# EAGLE design registers-tmp (EAGLE 5.11)

## Sheet 1 of 3
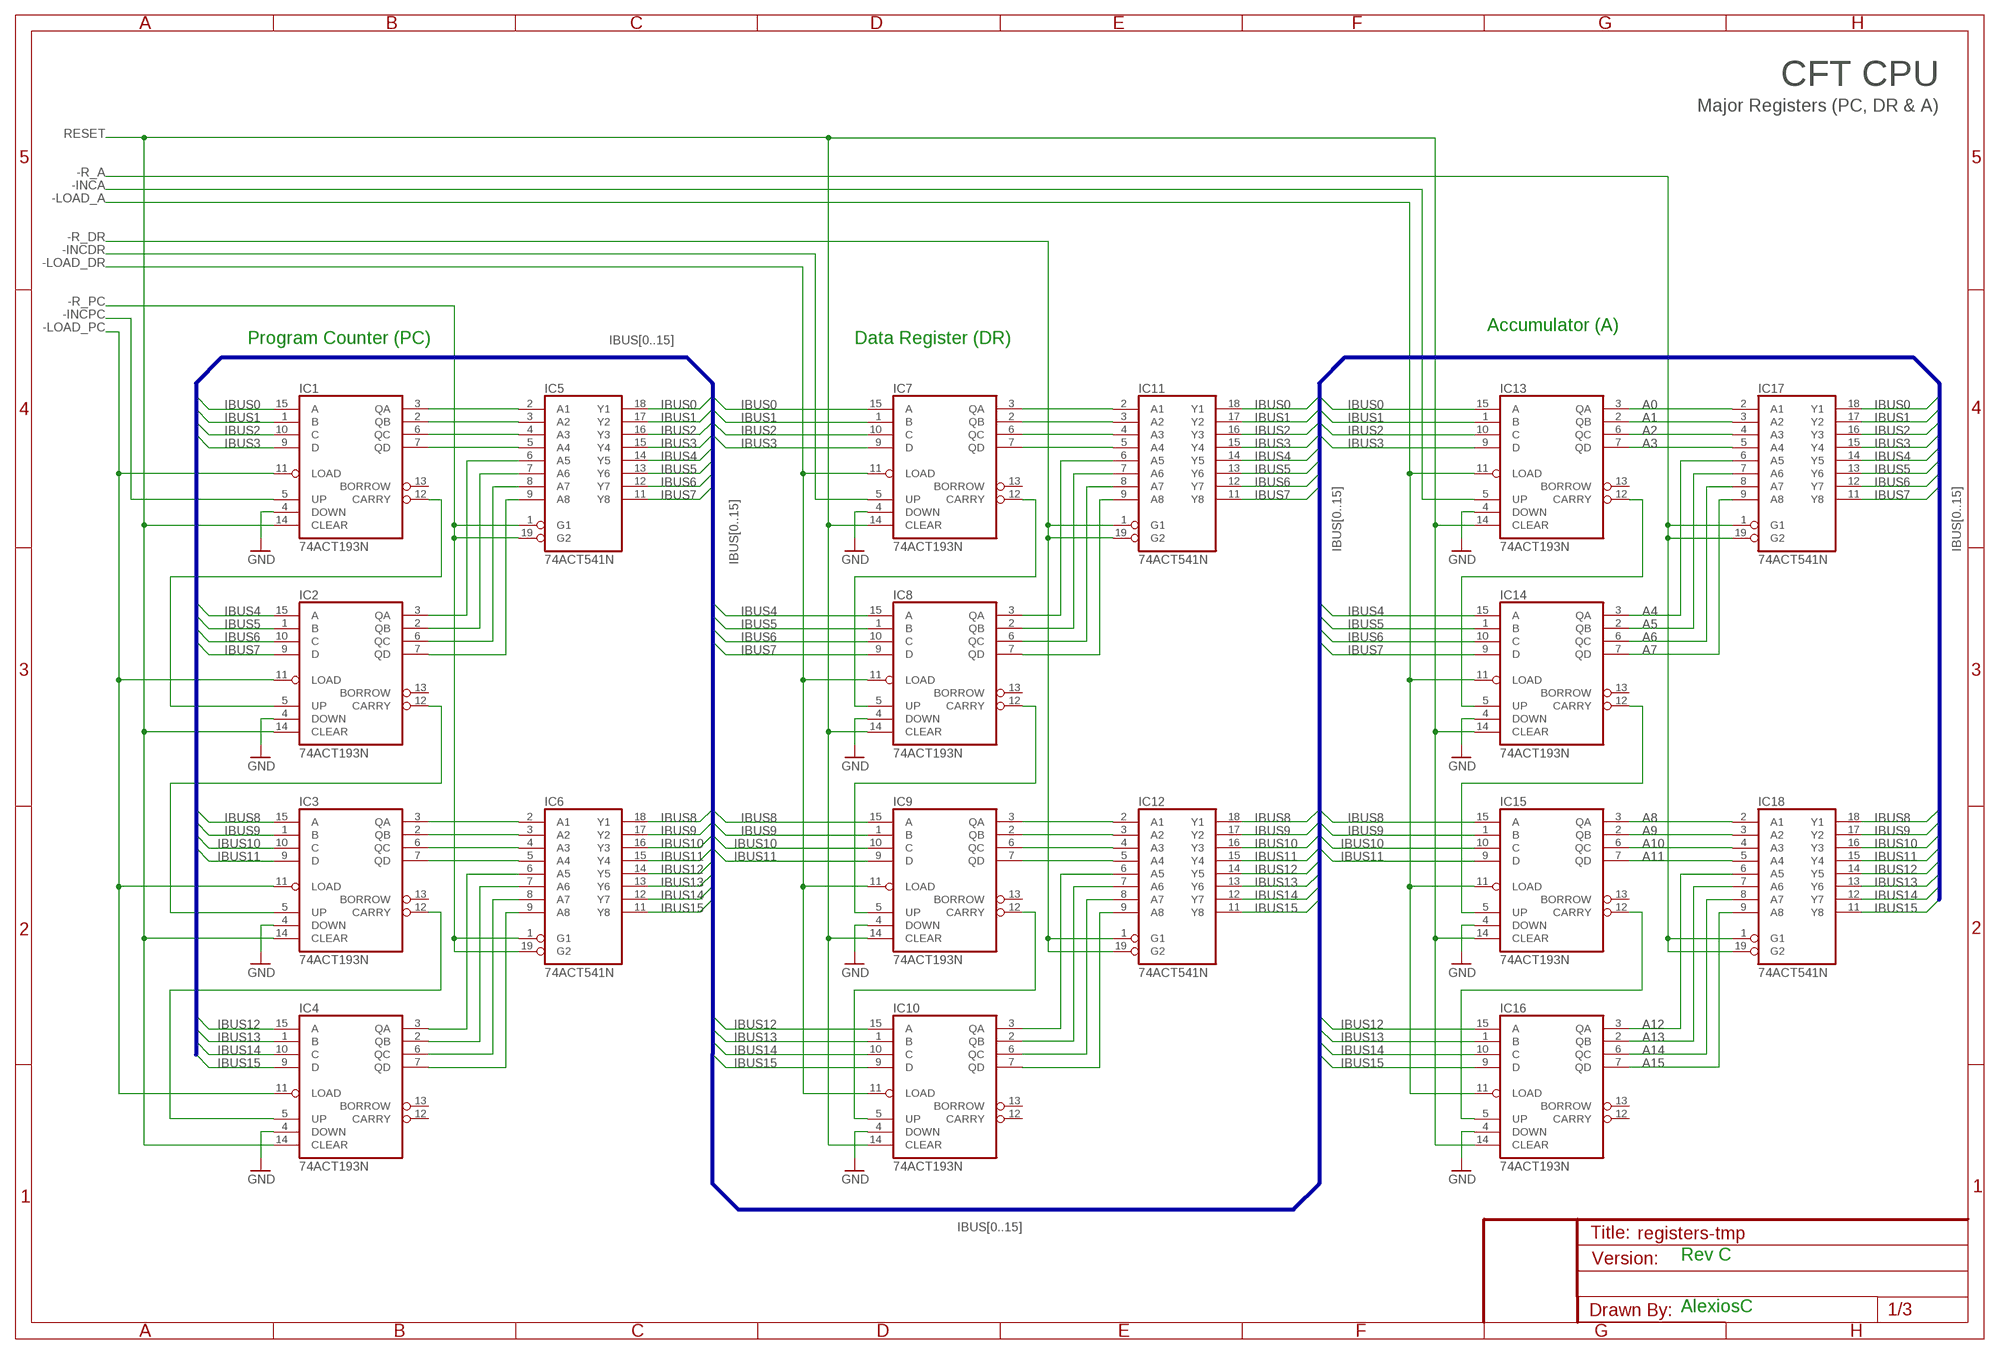
[diagram p0: schematic, sheet 1]

### Parts
IC1  74ACT193N  [DIL16]
IC2  74ACT193N  [DIL16]
IC3  74ACT193N  [DIL16]
IC4  74ACT193N  [DIL16]
IC5  74ACT541N  [DIL20]
IC6  74ACT541N  [DIL20]
IC7  74ACT193N  [DIL16]
IC8  74ACT193N  [DIL16]
IC9  74ACT193N  [DIL16]
IC10  74ACT193N  [DIL16]
IC11  74ACT541N  [DIL20]
IC12  74ACT541N  [DIL20]
IC13  74ACT193N  [DIL16]
IC14  74ACT193N  [DIL16]
IC15  74ACT193N  [DIL16]
IC16  74ACT193N  [DIL16]
IC17  74ACT541N  [DIL20]
IC18  74ACT541N  [DIL20]

### Nets
-INCA: IC13.5(UP) ; also sheet 3
-INCDR: IC7.5(UP) ; also sheet 3
-INCPC: IC1.5(UP) ; also sheet 3
-LOAD_A: IC13.11(LOAD) IC14.11(LOAD) IC15.11(LOAD) IC16.11(LOAD)
-LOAD_DR: IC7.11(LOAD) IC8.11(LOAD) IC9.11(LOAD) IC10.11(LOAD)
-LOAD_PC: IC1.11(LOAD) IC2.11(LOAD) IC3.11(LOAD) IC4.11(LOAD)
-R_A: IC17.1(G1) IC17.19(G2) IC18.1(G1) IC18.19(G2) ; also sheet 3
-R_DR: IC11.1(G1) IC11.19(G2) IC12.1(G1) IC12.19(G2) ; also sheet 3
-R_PC: IC5.1(G1) IC5.19(G2) IC6.1(G1) IC6.19(G2) ; also sheet 3
A0: IC13.3(QA) IC17.2(A1) ; also sheet 2
A1: IC13.2(QB) IC17.3(A2) ; also sheet 2
A2: IC13.6(QC) IC17.4(A3) ; also sheet 2
A3: IC13.7(QD) IC17.5(A4) ; also sheet 2
A4: IC14.3(QA) IC17.6(A5) ; also sheet 2
A5: IC14.2(QB) IC17.7(A6) ; also sheet 2
A6: IC14.6(QC) IC17.8(A7) ; also sheet 2
A7: IC14.7(QD) IC17.9(A8) ; also sheet 2
A8: IC15.3(QA) IC18.2(A1) ; also sheet 2
A9: IC15.2(QB) IC18.3(A2) ; also sheet 2
A10: IC15.6(QC) IC18.4(A3) ; also sheet 2
A11: IC15.7(QD) IC18.5(A4) ; also sheet 2
A12: IC16.3(QA) IC18.6(A5) ; also sheet 2
A13: IC16.2(QB) IC18.7(A6) ; also sheet 2
A14: IC16.6(QC) IC18.8(A7) ; also sheet 2
A15: IC16.7(QD) IC18.9(A8) ; also sheet 2
GND [Power]: IC1.4(DOWN) IC2.4(DOWN) IC3.4(DOWN) IC4.4(DOWN) IC7.4(DOWN) IC8.4(DOWN) IC9.4(DOWN) IC10.4(DOWN) IC13.4(DOWN) IC14.4(DOWN) IC15.4(DOWN) IC16.4(DOWN) ; also sheet 2,3
IBUS0: IC1.15(A) IC5.18(Y1) IC7.15(A) IC11.18(Y1) IC13.15(A) IC17.18(Y1) ; also sheet 3
IBUS1: IC1.1(B) IC5.17(Y2) IC7.1(B) IC11.17(Y2) IC13.1(B) IC17.17(Y2) ; also sheet 3
IBUS2: IC1.10(C) IC5.16(Y3) IC7.10(C) IC11.16(Y3) IC13.10(C) IC17.16(Y3) ; also sheet 3
IBUS3: IC1.9(D) IC5.15(Y4) IC7.9(D) IC11.15(Y4) IC13.9(D) IC17.15(Y4) ; also sheet 3
IBUS4: IC2.15(A) IC5.14(Y5) IC8.15(A) IC11.14(Y5) IC14.15(A) IC17.14(Y5) ; also sheet 3
IBUS5: IC2.1(B) IC5.13(Y6) IC8.1(B) IC11.13(Y6) IC14.1(B) IC17.13(Y6) ; also sheet 3
IBUS6: IC2.10(C) IC5.12(Y7) IC8.10(C) IC11.12(Y7) IC14.10(C) IC17.12(Y7) ; also sheet 3
IBUS7: IC2.9(D) IC5.11(Y8) IC8.9(D) IC11.11(Y8) IC14.9(D) IC17.11(Y8) ; also sheet 3
IBUS8: IC3.15(A) IC6.18(Y1) IC9.15(A) IC12.18(Y1) IC15.15(A) IC18.18(Y1) ; also sheet 3
IBUS9: IC3.1(B) IC6.17(Y2) IC9.1(B) IC12.17(Y2) IC15.1(B) IC18.17(Y2) ; also sheet 3
IBUS10: IC3.10(C) IC6.16(Y3) IC9.10(C) IC12.16(Y3) IC15.10(C) IC18.16(Y3) ; also sheet 3
IBUS11: IC3.9(D) IC6.15(Y4) IC9.9(D) IC12.15(Y4) IC15.9(D) IC18.15(Y4) ; also sheet 3
IBUS12: IC4.15(A) IC6.14(Y5) IC10.15(A) IC12.14(Y5) IC16.15(A) IC18.14(Y5) ; also sheet 3
IBUS13: IC4.1(B) IC6.13(Y6) IC10.1(B) IC12.13(Y6) IC16.1(B) IC18.13(Y6) ; also sheet 3
IBUS14: IC4.10(C) IC6.12(Y7) IC10.10(C) IC12.12(Y7) IC16.10(C) IC18.12(Y7) ; also sheet 3
IBUS15: IC4.9(D) IC6.11(Y8) IC10.9(D) IC12.11(Y8) IC16.9(D) IC18.11(Y8) ; also sheet 3
N$3: IC1.3(QA) IC5.2(A1)
N$4: IC1.2(QB) IC5.3(A2)
N$5: IC1.6(QC) IC5.4(A3)
N$6: IC1.7(QD) IC5.5(A4)
N$7: IC2.3(QA) IC5.6(A5)
N$8: IC2.2(QB) IC5.7(A6)
N$9: IC2.6(QC) IC5.8(A7)
N$10: IC2.7(QD) IC5.9(A8)
N$11: IC3.3(QA) IC6.2(A1)
N$12: IC3.2(QB) IC6.3(A2)
N$13: IC3.6(QC) IC6.4(A3)
N$14: IC4.3(QA) IC6.6(A5)
N$15: IC4.2(QB) IC6.7(A6)
N$22: IC3.7(QD) IC6.5(A4)
N$25: IC1.12(CARRY) IC2.5(UP)
N$26: IC13.12(CARRY) IC14.5(UP)
N$27: IC14.12(CARRY) IC15.5(UP)
N$28: IC7.12(CARRY) IC8.5(UP)
N$29: IC2.12(CARRY) IC3.5(UP)
N$30: IC8.12(CARRY) IC9.5(UP)
N$31: IC3.12(CARRY) IC4.5(UP)
N$32: IC4.6(QC) IC6.8(A7)
N$33: IC4.7(QD) IC6.9(A8)
N$39: IC9.12(CARRY) IC10.5(UP)
N$43: IC7.3(QA) IC11.2(A1)
N$44: IC7.2(QB) IC11.3(A2)
N$45: IC7.6(QC) IC11.4(A3)
N$46: IC7.7(QD) IC11.5(A4)
N$58: IC8.3(QA) IC11.6(A5)
N$66: IC8.2(QB) IC11.7(A6)
N$67: IC8.6(QC) IC11.8(A7)
N$68: IC8.7(QD) IC11.9(A8)
N$69: IC9.3(QA) IC12.2(A1)
N$70: IC9.2(QB) IC12.3(A2)
N$71: IC9.6(QC) IC12.4(A3)
N$72: IC9.7(QD) IC12.5(A4)
N$73: IC10.3(QA) IC12.6(A5)
N$74: IC10.2(QB) IC12.7(A6)
N$75: IC10.6(QC) IC12.8(A7)
N$76: IC10.7(QD) IC12.9(A8)
N$77: IC15.12(CARRY) IC16.5(UP)
RESET: IC1.14(CLEAR) IC2.14(CLEAR) IC3.14(CLEAR) IC4.14(CLEAR) IC7.14(CLEAR) IC8.14(CLEAR) IC9.14(CLEAR) IC10.14(CLEAR) IC13.14(CLEAR) IC14.14(CLEAR) IC15.14(CLEAR) IC16.14(CLEAR) ; also sheet 2
Unconnected: IC1.13(BORROW) IC2.13(BORROW) IC3.13(BORROW) IC4.12(CARRY) IC4.13(BORROW) IC7.13(BORROW) IC8.13(BORROW) IC9.13(BORROW) IC10.12(CARRY) IC10.13(BORROW) IC13.13(BORROW) IC14.13(BORROW) IC15.13(BORROW) IC16.12(CARRY) IC16.13(BORROW)

### Buses
IBUS[0..15]

### Notes on the sheet
- CFT CPU
- Major Registers (PC, DR & A)
- Accumulator (A)
- Program Counter (PC) | Data Register (DR)
- Rev C
- AlexiosC

## Sheet 2 of 3
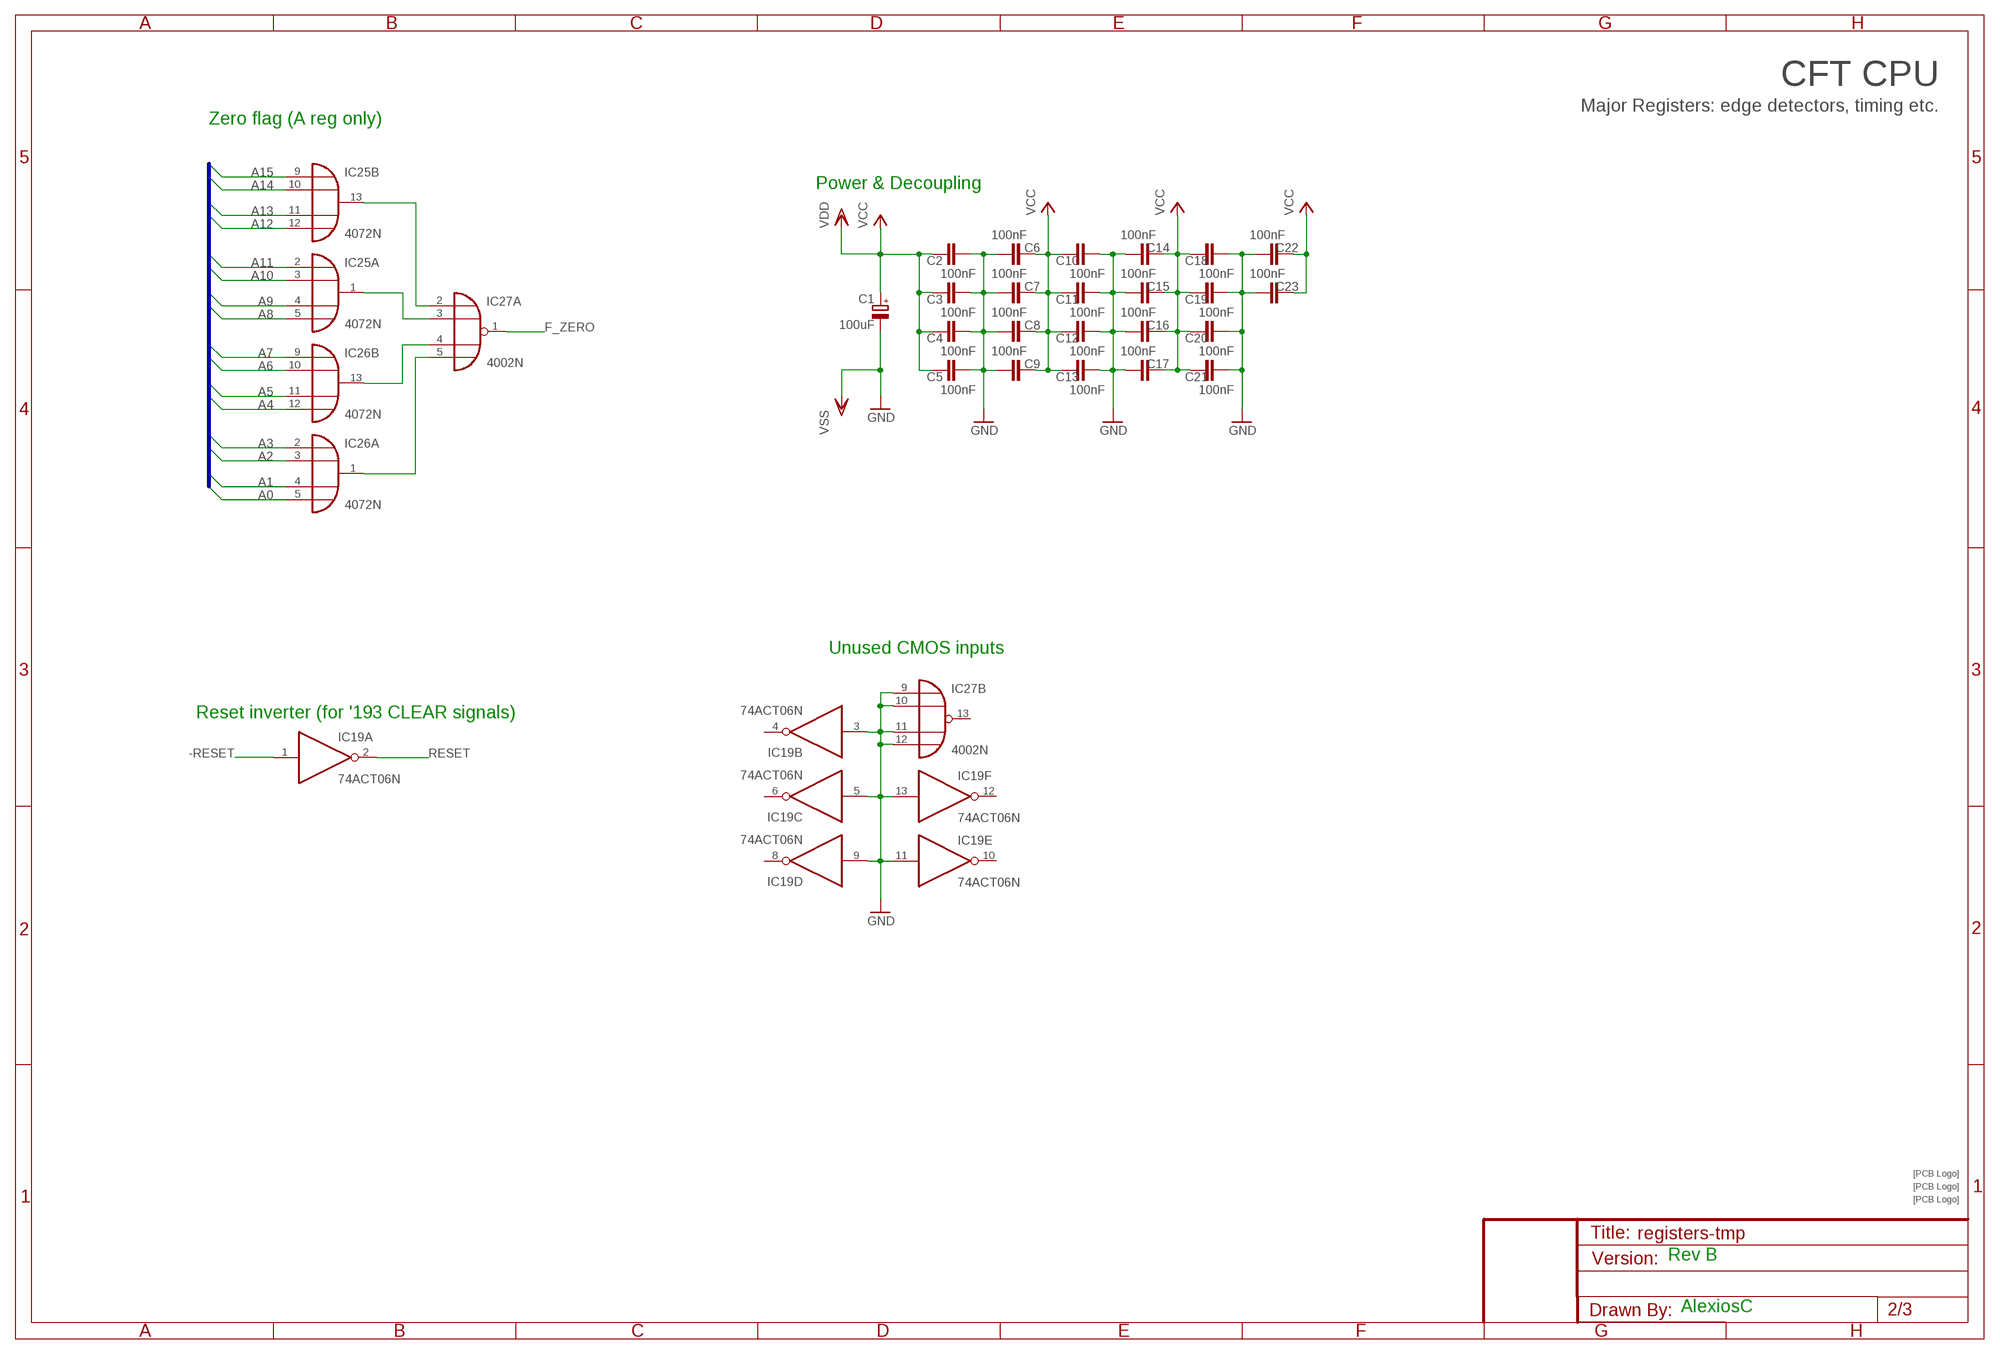
[diagram p1: schematic, sheet 2]

### Parts
C1  100uF  CPOL-EUE2.5-6  [E2,5-6]
C2  100nF  C-EU025-025X050  [C025-025X050]
C3  100nF  C-EU025-025X050  [C025-025X050]
C4  100nF  C-EU025-025X050  [C025-025X050]
C5  100nF  C-EU025-025X050  [C025-025X050]
C6  100nF  C-EU025-025X050  [C025-025X050]
C7  100nF  C-EU025-025X050  [C025-025X050]
C8  100nF  C-EU025-025X050  [C025-025X050]
C9  100nF  C-EU025-025X050  [C025-025X050]
C10  100nF  C-EU025-025X050  [C025-025X050]
C11  100nF  C-EU025-025X050  [C025-025X050]
C12  100nF  C-EU025-025X050  [C025-025X050]
C13  100nF  C-EU025-025X050  [C025-025X050]
C14  100nF  C-EU025-025X050  [C025-025X050]
C15  100nF  C-EU025-025X050  [C025-025X050]
C16  100nF  C-EU025-025X050  [C025-025X050]
C17  100nF  C-EU025-025X050  [C025-025X050]
C18  100nF  C-EU025-025X050  [C025-025X050]
C19  100nF  C-EU025-025X050  [C025-025X050]
C20  100nF  C-EU025-025X050  [C025-025X050]
C21  100nF  C-EU025-025X050  [C025-025X050]
C22  100nF  C-EU025-025X050  [C025-025X050]
C23  100nF  C-EU025-025X050  [C025-025X050]
IC19  74ACT06N  [DIL14]
IC25  4072N  [DIL14]
IC26  4072N  [DIL14]
IC27  4002N  [DIL14]
U$4  SIGNATUREPLANE  [SIGNATURE_PLANE]
U$5  SIGNATUREPLANE  [SIGNATURE_PLANE]
U$6  SIGNATURESILK  [SIGNATURE]

### Nets
-RESET: IC19.1(A:I) ; also sheet 3
A0: IC26.5(A:I3) ; also sheet 1
A1: IC26.4(A:I2) ; also sheet 1
A2: IC26.3(A:I1) ; also sheet 1
A3: IC26.2(A:I0) ; also sheet 1
A4: IC26.12(B:I3) ; also sheet 1
A5: IC26.11(B:I2) ; also sheet 1
A6: IC26.10(B:I1) ; also sheet 1
A7: IC26.9(B:I0) ; also sheet 1
A8: IC25.5(A:I3) ; also sheet 1
A9: IC25.4(A:I2) ; also sheet 1
A10: IC25.3(A:I1) ; also sheet 1
A11: IC25.2(A:I0) ; also sheet 1
A12: IC25.12(B:I3) ; also sheet 1
A13: IC25.11(B:I2) ; also sheet 1
A14: IC25.10(B:I1) ; also sheet 1
A15: IC25.9(B:I0) ; also sheet 1
F_ZERO: IC27.1(A:O) ; also sheet 3
GND [Power]: C1.- C2.1 C3.1 C4.1 C5.1 C6.1 C7.1 C8.1 C9.1 C10.1 C11.1 C12.1 C13.1 C14.1 C15.1 C16.1 C17.1 C18.1 C19.1 C20.1 C21.1 C22.1 C23.1 IC19.3(B:I) IC19.5(C:I) IC19.9(D:I) IC19.11(E:I) IC19.13(F:I) IC27.9(B:I0) IC27.10(B:I1) IC27.11(B:I2) IC27.12(B:I3) ; supply symbol labelled VSS ; also sheet 1,3
N$17: IC25.13(B:O) IC27.2(A:I0)
N$18: IC25.1(A:O) IC27.3(A:I1)
N$19: IC26.13(B:O) IC27.4(A:I2)
N$20: IC26.1(A:O) IC27.5(A:I3)
RESET: IC19.2(A:O) ; also sheet 1
VCC [Power]: C1.+ C2.2 C3.2 C4.2 C5.2 C6.2 C7.2 C8.2 C9.2 C10.2 C11.2 C12.2 C13.2 C14.2 C15.2 C16.2 C17.2 C18.2 C19.2 C20.2 C21.2 C22.2 C23.2 ; supply symbol labelled VDD ; also sheet 3
Unconnected: IC19.4(B:O) IC19.6(C:O) IC19.8(D:O) IC19.10(E:O) IC19.12(F:O) IC27.13(B:O)

### Buses
REG[0..15]

### Notes on the sheet
- CFT CPU
- Major Registers: edge detectors, timing etc.
- Zero flag (A reg only)
- Power & Decoupling
- Unused CMOS inputs
- Reset inverter (for '193 CLEAR signals)
- Rev B
- AlexiosC

## Sheet 3 of 3
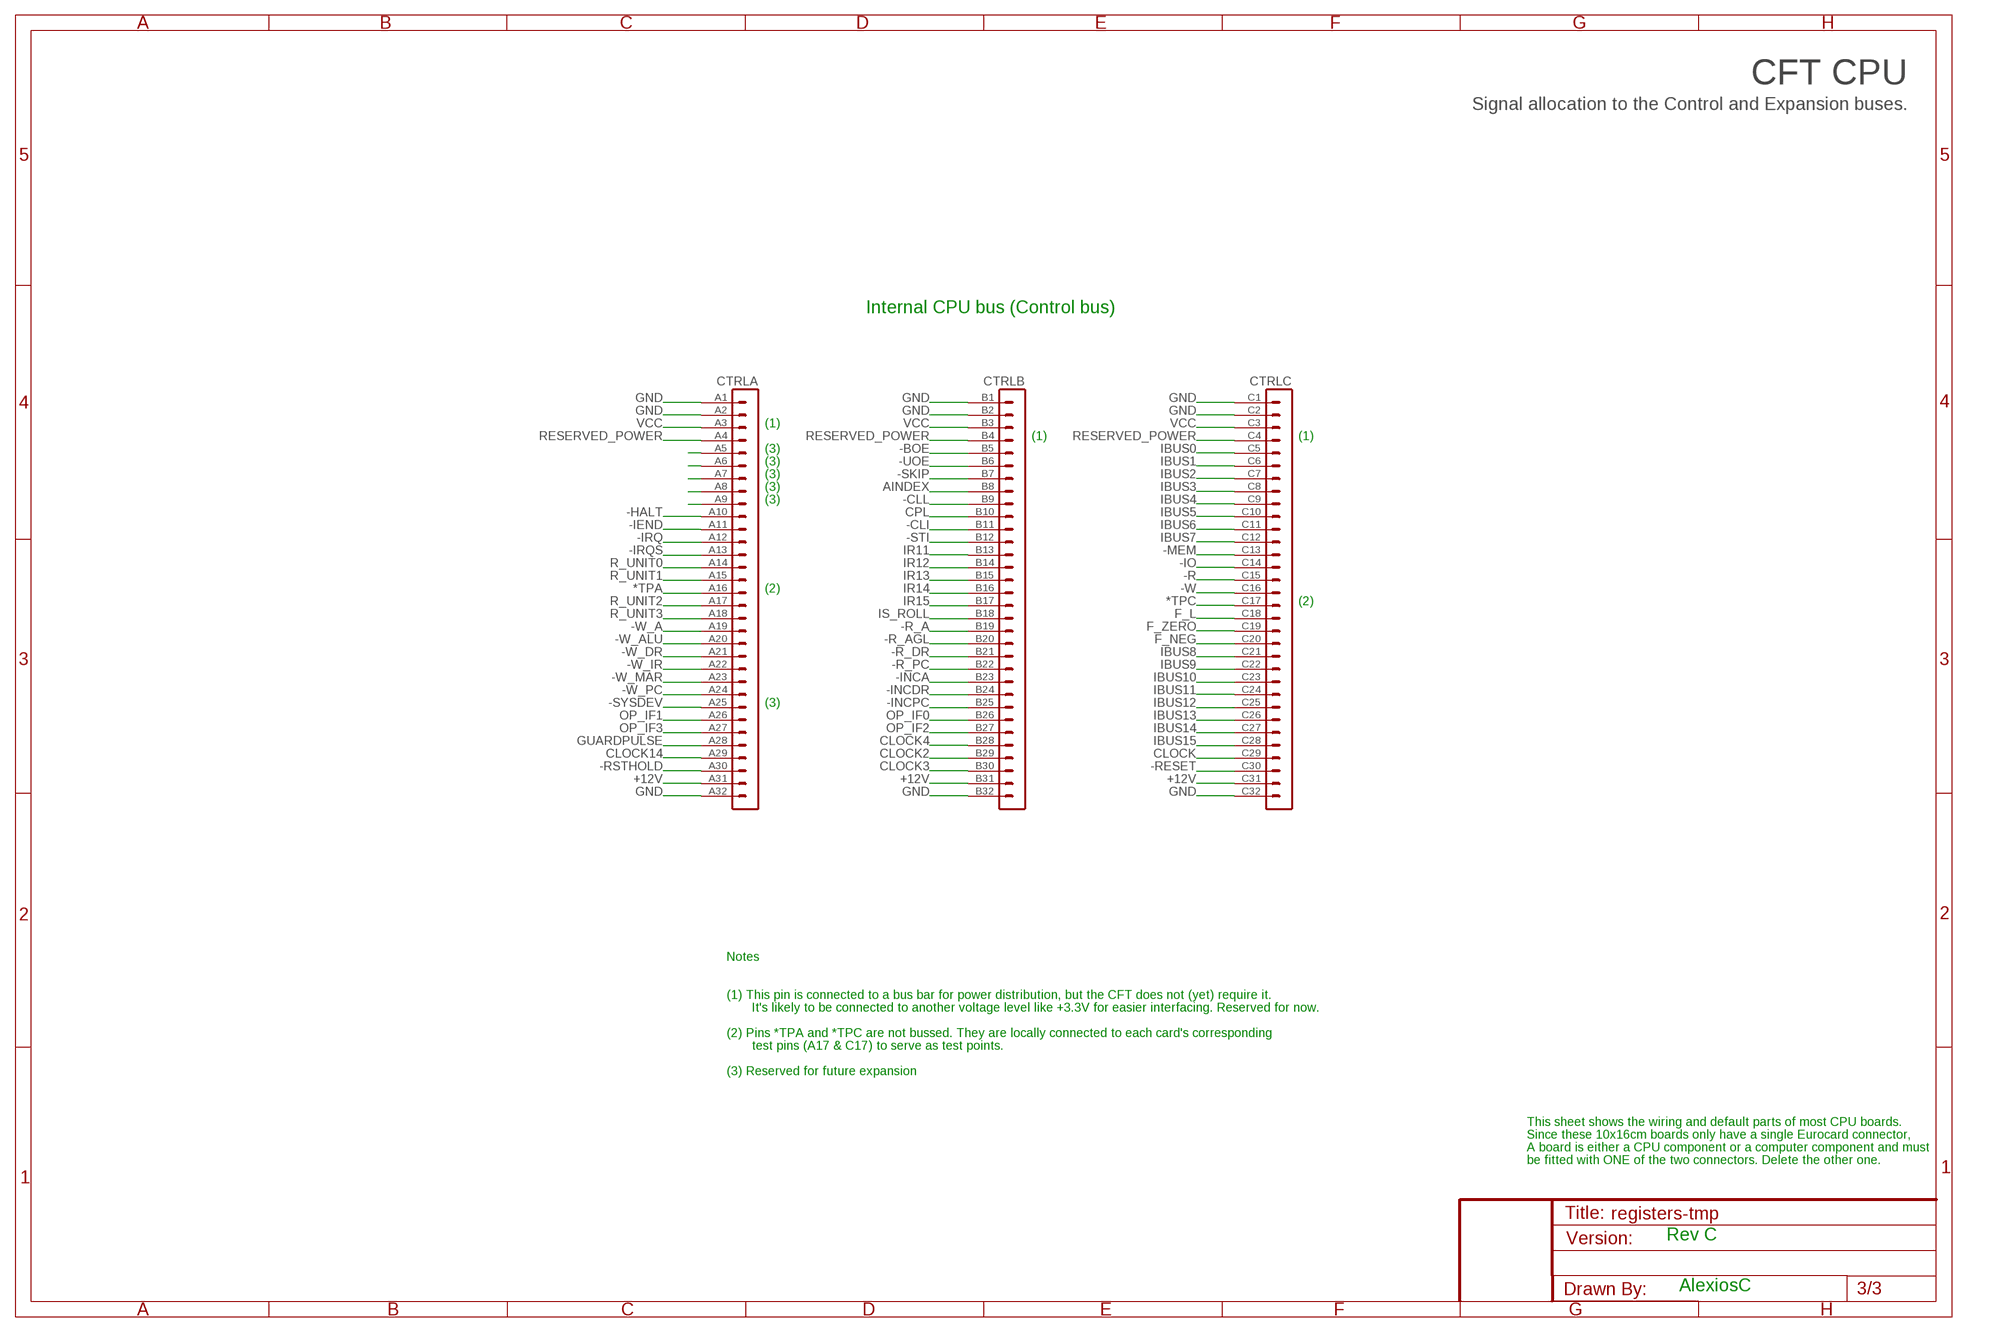
[diagram p2: schematic, sheet 3]

### Parts
CTRL  VG96-3B  [VG96B]

### Nets
*TPA: CTRL.A16
*TPC: CTRL.C17
+12V [12V]: CTRL.A31 CTRL.B31 CTRL.C31
-BOE: CTRL.B5
-CLI: CTRL.B11
-CLL: CTRL.B9
-HALT: CTRL.A10
-IEND: CTRL.A11
-INCA: CTRL.B23 ; also sheet 1
-INCDR: CTRL.B24 ; also sheet 1
-INCPC: CTRL.B25 ; also sheet 1
-IO: CTRL.C14
-IRQ: CTRL.A12
-IRQS: CTRL.A13
-MEM: CTRL.C13
-R: CTRL.C15
-R_A: CTRL.B19 ; also sheet 1
-R_AGL: CTRL.B20
-R_DR: CTRL.B21 ; also sheet 1
-R_PC: CTRL.B22 ; also sheet 1
-RESET: CTRL.C30 ; also sheet 2
-RSTHOLD: CTRL.A30
-SKIP: CTRL.B7
-STI: CTRL.B12
-SYSDEV: CTRL.A25
-UOE: CTRL.B6
-W: CTRL.C16
-W_A: CTRL.A19
-W_ALU: CTRL.A20
-W_DR: CTRL.A21
-W_IR: CTRL.A22
-W_MAR: CTRL.A23
-W_PC: CTRL.A24
AINDEX: CTRL.B8
CLOCK: CTRL.C29
CLOCK2: CTRL.B29
CLOCK3: CTRL.B30
CLOCK4: CTRL.B28
CLOCK14: CTRL.A29
CPL: CTRL.B10
F_L: CTRL.C18
F_NEG: CTRL.C20
F_ZERO: CTRL.C19 ; also sheet 2
GND [Power]: CTRL.A1 CTRL.A2 CTRL.A32 CTRL.B1 CTRL.B2 CTRL.B32 CTRL.C1 CTRL.C2 CTRL.C32 ; also sheet 1,2
GUARDPULSE: CTRL.A28
IBUS0: CTRL.C5 ; also sheet 1
IBUS1: CTRL.C6 ; also sheet 1
IBUS2: CTRL.C7 ; also sheet 1
IBUS3: CTRL.C8 ; also sheet 1
IBUS4: CTRL.C9 ; also sheet 1
IBUS5: CTRL.C10 ; also sheet 1
IBUS6: CTRL.C11 ; also sheet 1
IBUS7: CTRL.C12 ; also sheet 1
IBUS8: CTRL.C21 ; also sheet 1
IBUS9: CTRL.C22 ; also sheet 1
IBUS10: CTRL.C23 ; also sheet 1
IBUS11: CTRL.C24 ; also sheet 1
IBUS12: CTRL.C25 ; also sheet 1
IBUS13: CTRL.C26 ; also sheet 1
IBUS14: CTRL.C27 ; also sheet 1
IBUS15: CTRL.C28 ; also sheet 1
IR11: CTRL.B13
IR12: CTRL.B14
IR13: CTRL.B15
IR14: CTRL.B16
IR15: CTRL.B17
IS_ROLL: CTRL.B18
N$2: CTRL.A5
N$48: CTRL.A9
N$49: CTRL.A8
N$50: CTRL.A7
N$51: CTRL.A6
OP_IF0: CTRL.B26
OP_IF1: CTRL.A26
OP_IF2: CTRL.B27
OP_IF3: CTRL.A27
R_UNIT0: CTRL.A14
R_UNIT1: CTRL.A15
R_UNIT2: CTRL.A17
R_UNIT3: CTRL.A18
RESERVED_POWER: CTRL.A4 CTRL.B4 CTRL.C4
VCC [Power]: CTRL.A3 CTRL.B3 CTRL.C3 ; also sheet 2

### Notes on the sheet
- CFT CPU
- Signal allocation to the Control and Expansion buses.
- Internal CPU bus (Control bus)
- (1)
- (1) | (1)
- (3)
- (3)
- (3)
- (3)
- (3)
- (2)
- (2)
- (3)
- Notes
- (1) This pin is connected to a bus bar for power distribution, but the CFT does not (yet) require it.
- It's likely to be connected to another voltage level like +3.3V for easier interfacing. Reserved for now.
- (2) Pins *TPA and *TPC are not bussed. They are locally connected to each card's corresponding
- test pins (A17 & C17) to serve as test points.
- (3) Reserved for future expansion
- This sheet shows the wiring and default parts of most CPU boards.
- Since these 10x16cm boards only have a single Eurocard connector,
- A board is either a CPU component or a computer component and must
- be fitted with ONE of the two connectors. Delete the other one.
- Rev C
- AlexiosC

## Power pins joined to a net without a drawn wire
GND: IC1.8(GND) IC2.8(GND) IC3.8(GND) IC4.8(GND) IC5.10(GND) IC6.10(GND) IC7.8(GND) IC8.8(GND) IC9.8(GND) IC10.8(GND) IC11.10(GND) IC12.10(GND) IC13.8(GND) IC14.8(GND) IC15.8(GND) IC16.8(GND) IC17.10(GND) IC18.10(GND) IC19.7(P:GND) IC25.7(P:VSS) IC26.7(P:VSS) IC27.7(P:VSS)
VCC: IC1.16(VCC) IC2.16(VCC) IC3.16(VCC) IC4.16(VCC) IC5.20(VCC) IC6.20(VCC) IC7.16(VCC) IC8.16(VCC) IC9.16(VCC) IC10.16(VCC) IC11.20(VCC) IC12.20(VCC) IC13.16(VCC) IC14.16(VCC) IC15.16(VCC) IC16.16(VCC) IC17.20(VCC) IC18.20(VCC) IC19.14(P:VCC) IC25.14(P:VDD) IC26.14(P:VDD) IC27.14(P:VDD)

## Library data of the parts
C1 = rcl:CPOL-EU: POLARIZED CAPACITOR, European symbol
C2-C23 = rcl:C-EU: CAPACITOR, European symbol
CTRL = 19inch:VG96-3: PCB EUROCARD, 96-pin type C/ABC, 2.54 mm
IC1-IC4 IC7-IC10 IC13-IC16 = alexios:74*193: Presettable Synchronous Binary Up/Down Counter Up/down 4-bit binary counter with load and clear inputs, and borrow and carry outputs. Farnell description: <http://uk.farnell.com/nxp/74hct193n/ic-74hct-cmos-74hct193-dip16-5v/dp/382218> Order Code: 382218 Manufacturer Part No: 74HCT193N RoHS : Yes Description: IC, 74HCT CMOS, 74HCT193, DIP16, 5V Counter Type:Binary Clock Frequency:47MHz Count Maximum:15 Supply Voltage Range:4.5V to 5.5V Logic Case Style:DIP No. of Pins:16 Operating Temperature Range:-40°C to +125°C Base Number:74 Clock Frequency Max:43MHz Count Max:16 Counter Measuring Functions:Presettable Synchronous Binary Up / Down Counter Device Marking:74HCT193 IC Generic Number:74HCT193 Logic Function Number:193 Logic IC Base Number:74193 Logic IC Family:HCT Logic IC Function:Presettable Synchronous 4bit Binary Up/Down Counter No. of Gates:1 No. of Inputs:4 Operating Temperature Max:125°C Operating Temperature Min:-40°C Package / Case:DIP Supply Voltage:5V Supply Voltage Max:5.5V Supply Voltage Min:4.5V Termination Type:Through Hole
IC5 IC6 IC11 IC12 IC17 IC18 = 74xx-eu:74*541: Octal BUFFER and LINE DRIVER, 3-state
IC19 = 74xx-eu:74*06: Hex INVERTER, open collector high-voltage output
IC25 IC26 = 40xx:4072: Dual 4-input OR
IC27 = 40xx:4002: 4-input NOR
U$4-U$6 = alexios:SIGNATURE: Soup signature

## Net classes
1 Power: width 1.016 mm, clearance 0.305 mm
2 12V: width 1.016 mm, clearance 0.61 mm

## Board
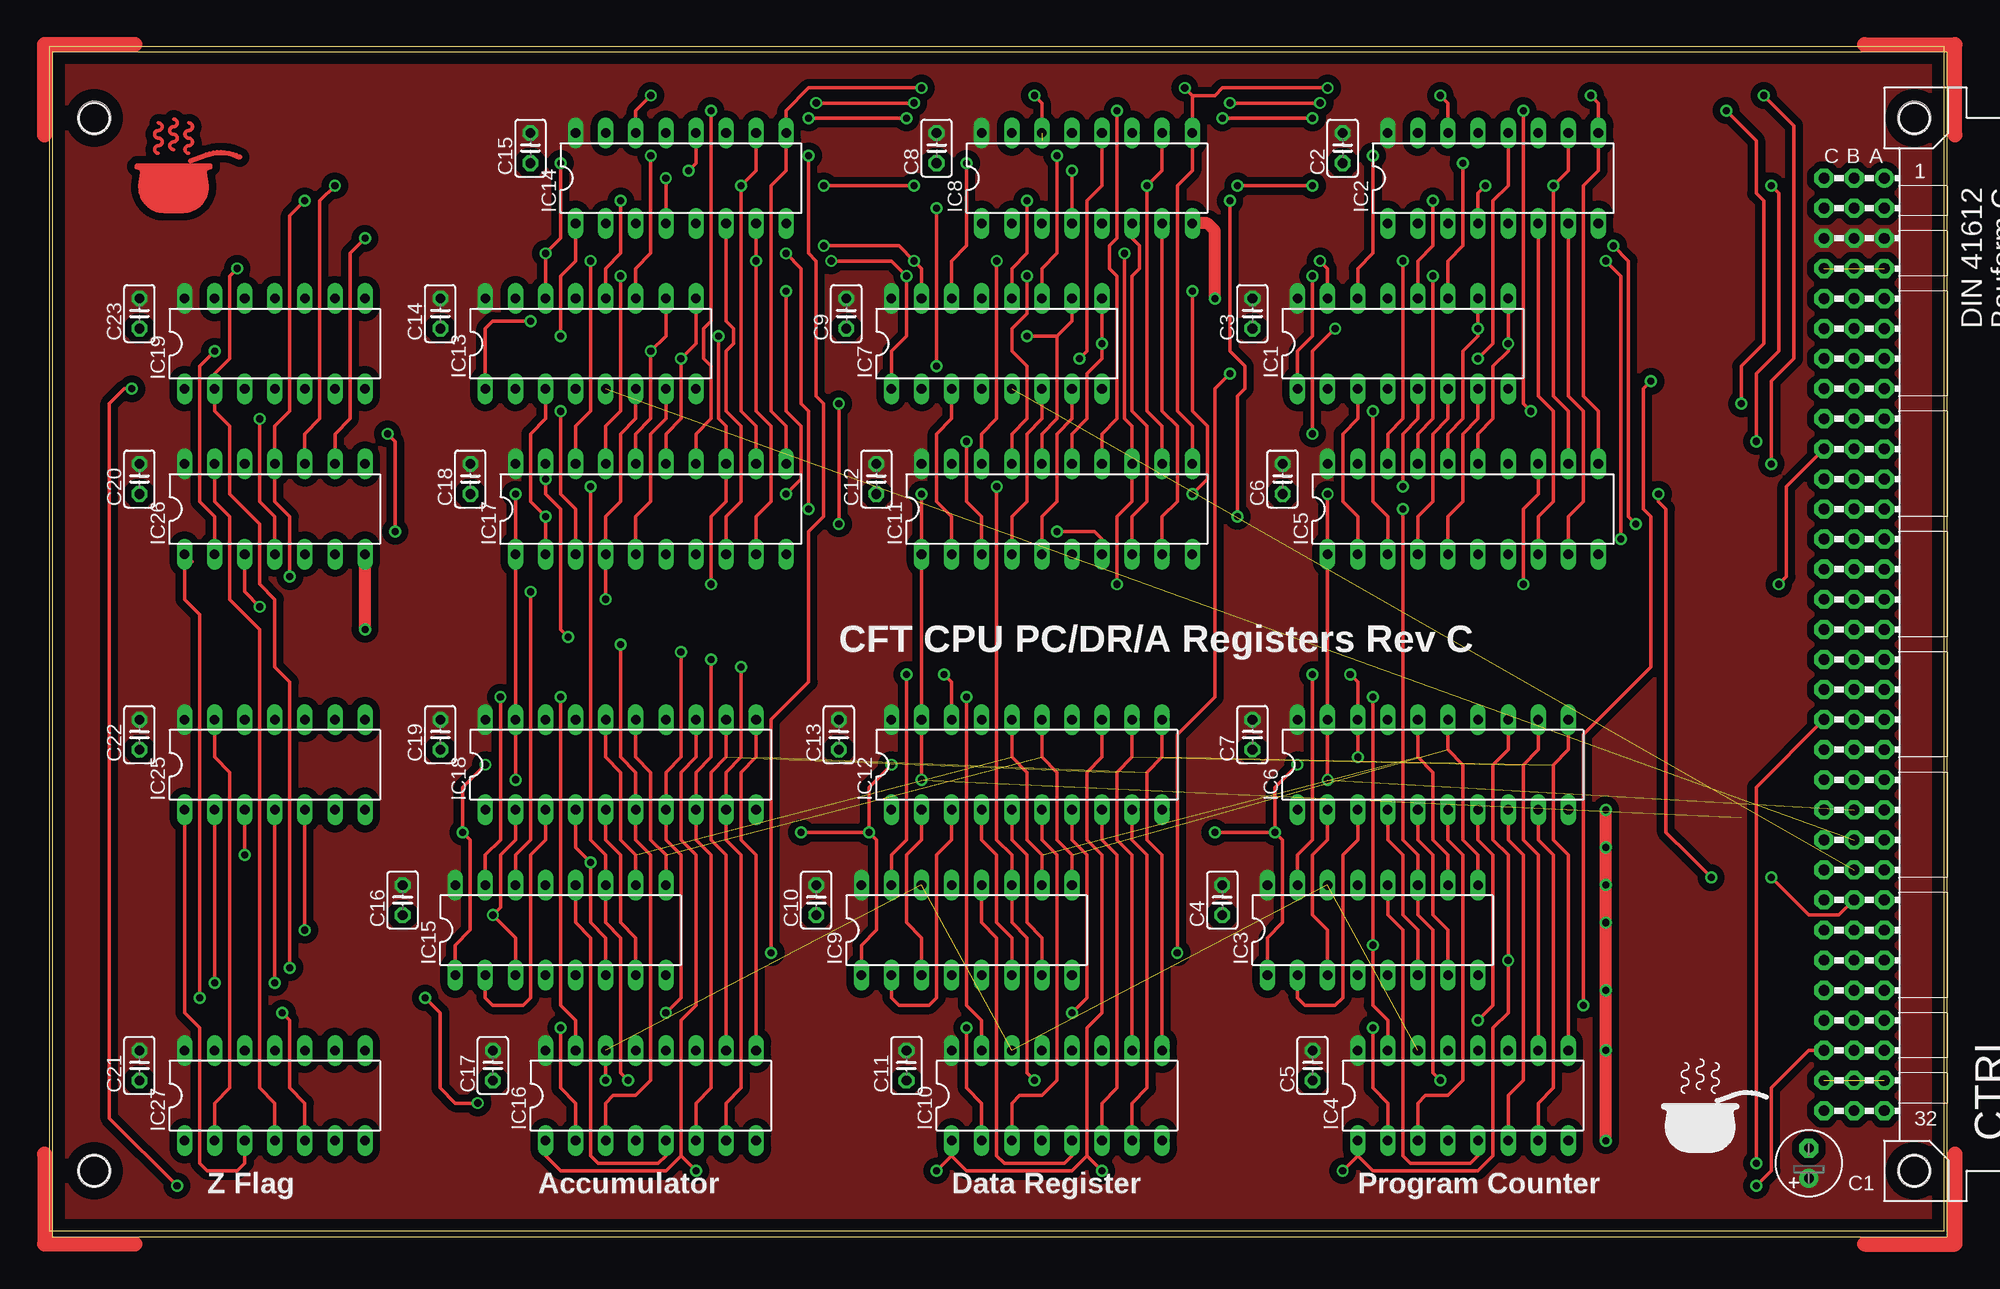
[diagram p3: board, top side]
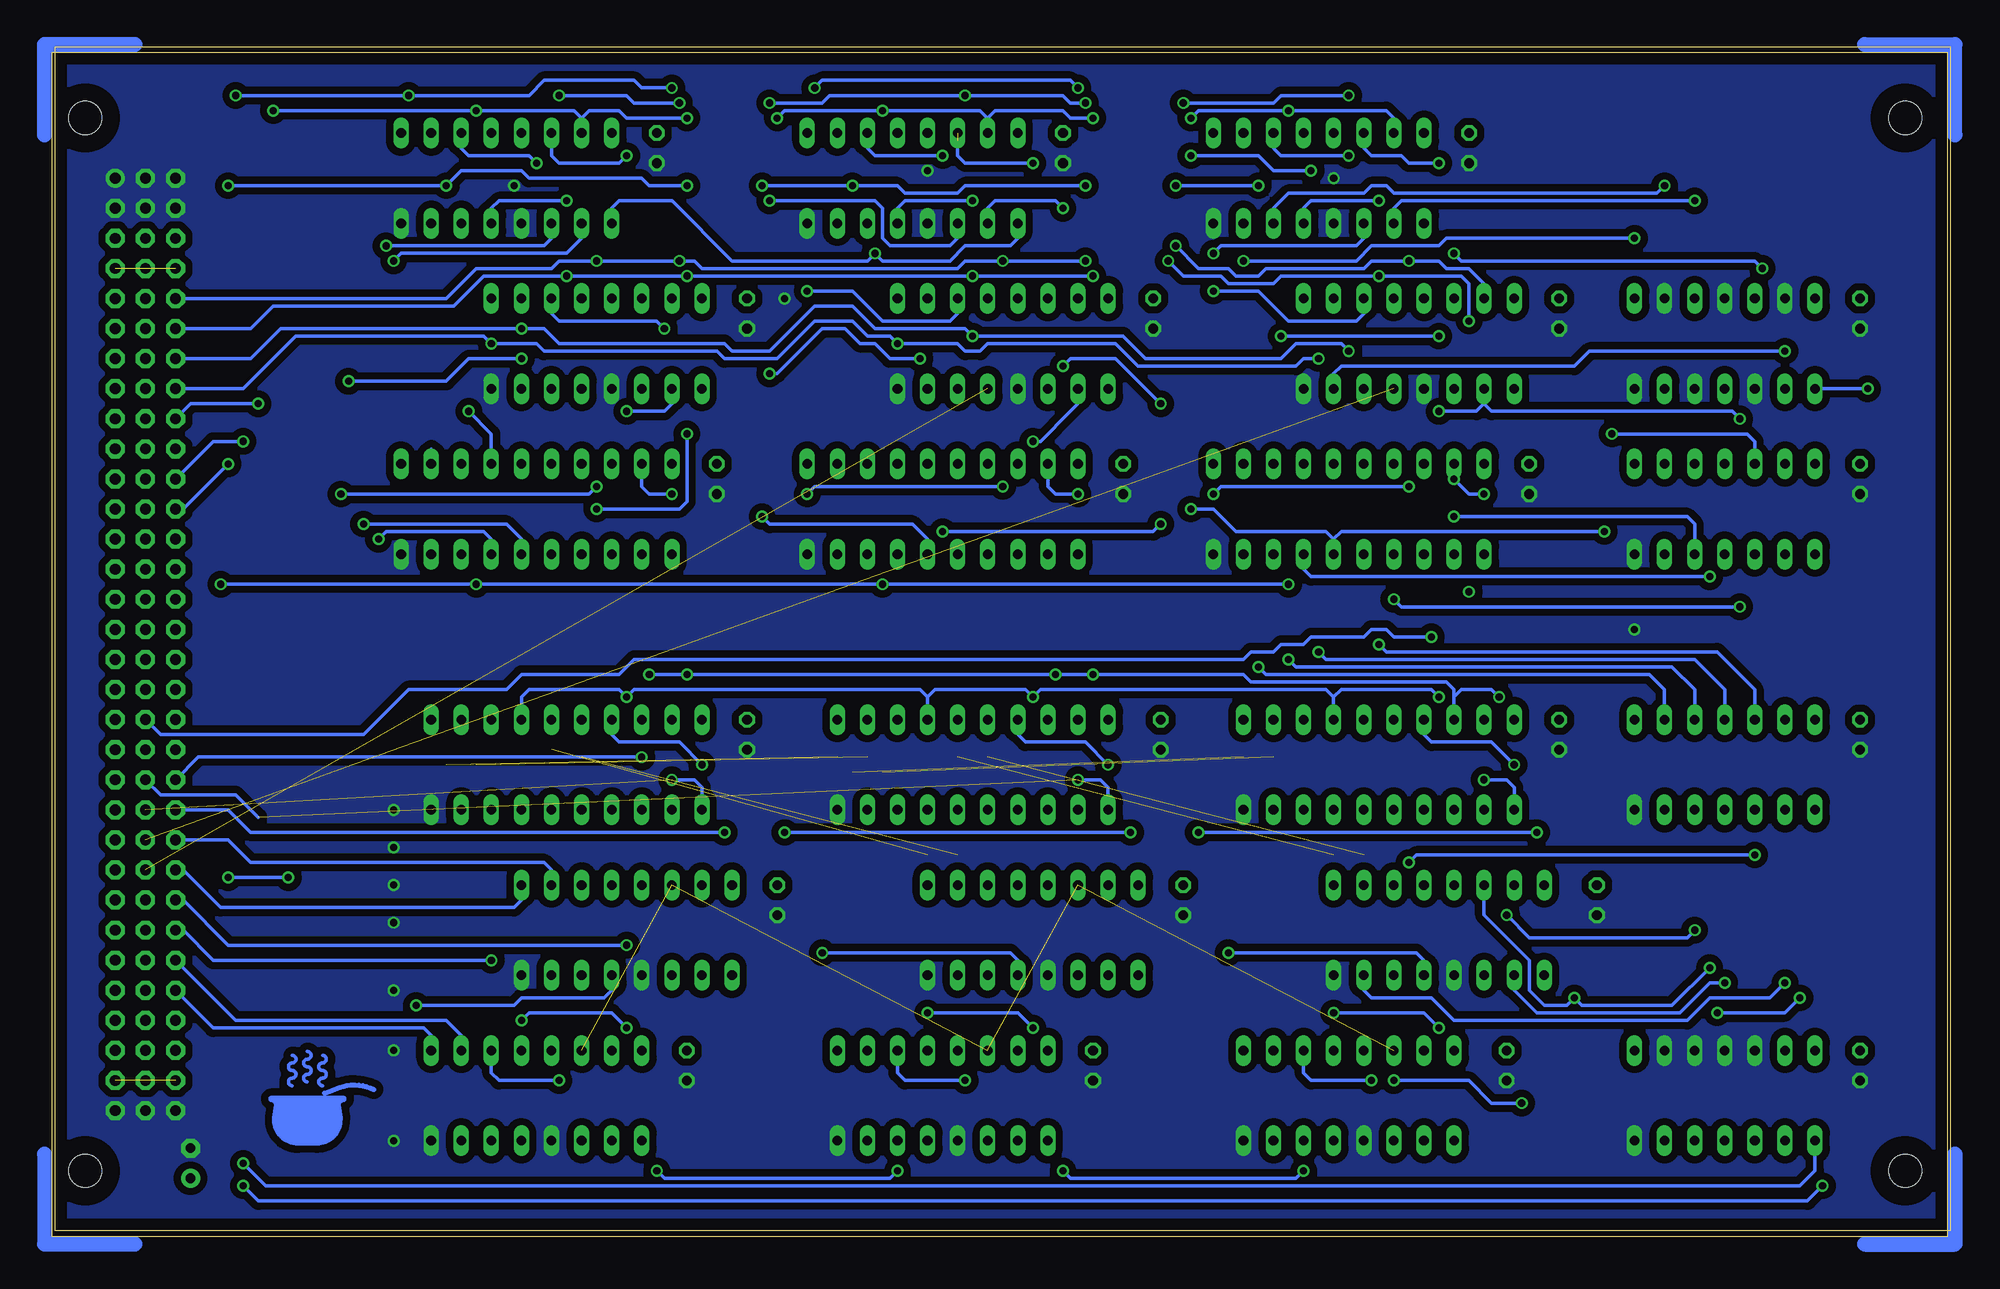
[diagram p4: board, bottom side, seen from below]

Size 160 x 100 mm. Coordinates in mm from the lower left corner, seen from the top.
Outline: 0,0 160,0 160,100 0,100 0,0
Copper layers (1*16): Top 0.035mm / dielectric 1.5mm / Bottom 0.035mm
Design rules "olimex-10mil *": minimum track width 10mil, minimum drill 24mil, track to track 10mil, track to pad 10mil, pad to pad 10mil, via to via 10mil, smd to smd 10mil, copper to edge 40mil, drill to drill 10mil, minimum pad ring 10mil, minimum via ring 8mil, stop-mask expansion 0mil, vias tented up to drill 0mil, thermal gap 10mil

### Footprints (pad centres in the part's own frame; a part is rotated, then mirrored left to right if it is on the bottom)
E2,5-6 = drill 0.813 pad 1.6 round: + -1.27,0 | drill 0.813 pad 1.6 octagon: - 1.27,0
C025-025X050 = drill 0.813 octagon: 1 -1.27,0; 2 1.27,0
VG96B = drill 0.914 pad 1.6 round: A1 154.94,39.37 | drill 0.914 pad 1.6 octagon: A2 154.94,36.83; A3 154.94,34.29; A4 154.94,31.75; A5 154.94,29.21; A6 154.94,26.67; A7 154.94,24.13; A8 154.94,21.59; A9 154.94,19.05; A10 154.94,16.51; A11 154.94,13.97; A12 154.94,11.43; A13 154.94,8.89; A14 154.94,6.35; A15 154.94,3.81; A16 154.94,1.27; A17 154.94,-1.27; A18 154.94,-3.81; A19 154.94,-6.35; A20 154.94,-8.89; A21 154.94,-11.43; A22 154.94,-13.97; A23 154.94,-16.51; A24 154.94,-19.05; A25 154.94,-21.59; A26 154.94,-24.13; A27 154.94,-26.67; A28 154.94,-29.21; A29 154.94,-31.75; A30 154.94,-34.29; A31 154.94,-36.83; A32 154.94,-39.37; B1 152.4,39.37; B2 152.4,36.83; B3 152.4,34.29; B4 152.4,31.75; B5 152.4,29.21; B6 152.4,26.67; B7 152.4,24.13; B8 152.4,21.59; B9 152.4,19.05; B10 152.4,16.51; B11 152.4,13.97; B12 152.4,11.43; B13 152.4,8.89; B14 152.4,6.35; B15 152.4,3.81; B16 152.4,1.27; B17 152.4,-1.27; B18 152.4,-3.81; B19 152.4,-6.35; B20 152.4,-8.89; B21 152.4,-11.43; B22 152.4,-13.97; B23 152.4,-16.51; B24 152.4,-19.05; B25 152.4,-21.59; B26 152.4,-24.13; B27 152.4,-26.67; B28 152.4,-29.21; B29 152.4,-31.75; B30 152.4,-34.29; B31 152.4,-36.83; B32 152.4,-39.37; C1 149.86,39.37; C2 149.86,36.83; C3 149.86,34.29; C4 149.86,31.75; C5 149.86,29.21; C6 149.86,26.67; C7 149.86,24.13; C8 149.86,21.59; C9 149.86,19.05; C10 149.86,16.51; C11 149.86,13.97; C12 149.86,11.43; C13 149.86,8.89; C14 149.86,6.35; C15 149.86,3.81; C16 149.86,1.27; C17 149.86,-1.27; C18 149.86,-3.81; C19 149.86,-6.35; C20 149.86,-8.89; C21 149.86,-11.43; C22 149.86,-13.97; C23 149.86,-16.51; C24 149.86,-19.05; C25 149.86,-21.59; C26 149.86,-24.13; C27 149.86,-26.67; C28 149.86,-29.21; C29 149.86,-31.75; C30 149.86,-34.29; C31 149.86,-36.83; C32 149.86,-39.37 | hole 2.794: 157.48,44.45; 157.48,-44.45; 3.81,44.45; 3.81,-44.45
DIL16 = drill 0.813 long: 1 -8.89,-3.81; 2 -6.35,-3.81; 3 -3.81,-3.81; 4 -1.27,-3.81; 5 1.27,-3.81; 6 3.81,-3.81; 7 6.35,-3.81; 8 8.89,-3.81; 9 8.89,3.81; 10 6.35,3.81; 11 3.81,3.81; 12 1.27,3.81; 13 -1.27,3.81; 14 -3.81,3.81; 15 -6.35,3.81; 16 -8.89,3.81
DIL20 = drill 0.813 long: 1 -11.43,-3.81; 2 -8.89,-3.81; 3 -6.35,-3.81; 4 -3.81,-3.81; 5 -1.27,-3.81; 6 1.27,-3.81; 7 3.81,-3.81; 8 6.35,-3.81; 9 8.89,-3.81; 10 11.43,-3.81; 11 11.43,3.81; 12 8.89,3.81; 13 6.35,3.81; 14 3.81,3.81; 15 1.27,3.81; 16 -1.27,3.81; 17 -3.81,3.81; 18 -6.35,3.81; 19 -8.89,3.81; 20 -11.43,3.81
DIL14 = drill 0.813 long: 1 -7.62,-3.81; 2 -5.08,-3.81; 3 -2.54,-3.81; 4 0,-3.81; 5 2.54,-3.81; 6 5.08,-3.81; 7 7.62,-3.81; 8 7.62,3.81; 9 5.08,3.81; 10 2.54,3.81; 11 0,3.81; 12 -2.54,3.81; 13 -5.08,3.81; 14 -7.62,3.81

### Placement (x,y rotation side)
C1  148.59,5.71 90 top
C2  109.22,91.44 90 top
C3  101.6,77.47 90 top
C4  99.06,27.94 90 top
C5  106.68,13.97 90 top
C6  104.14,63.5 90 top
C7  101.6,41.91 90 top
C8  74.93,91.44 90 top
C9  67.31,77.47 90 top
C10  64.77,27.94 90 top
C11  72.39,13.97 90 top
C12  69.85,63.5 90 top
C13  66.67,41.91 90 top
C14  33.02,77.47 90 top
C15  40.64,91.44 90 top
C16  29.84,27.94 90 top
C17  37.47,13.97 90 top
C18  35.56,63.5 90 top
C19  33.02,41.91 90 top
C20  7.62,63.5 90 top
C21  7.62,13.97 90 top
C22  7.62,41.91 90 top
C23  7.62,77.47 90 top
CTRL  0,49.53 0 top
IC1  114.3,74.93 0 top
IC2  121.92,88.9 0 top
IC3  111.76,25.4 0 top
IC4  119.38,11.43 0 top
IC5  119.38,60.96 0 top
IC6  116.84,39.37 0 top
IC7  80.01,74.93 0 top
IC8  87.63,88.9 0 top
IC9  77.47,25.4 0 top
IC10  85.09,11.43 0 top
IC11  85.09,60.96 0 top
IC12  82.55,39.37 0 top
IC13  45.72,74.93 0 top
IC14  53.34,88.9 0 top
IC15  43.18,25.4 0 top
IC16  50.8,11.43 0 top
IC17  50.8,60.96 0 top
IC18  48.26,39.37 0 top
IC19  19.05,74.93 0 top
IC25  19.05,39.37 0 top
IC26  19.05,60.96 0 top
IC27  19.05,11.43 0 top
U$4  141.6,6.99 0 bottom
U$5  7.62,85.72 0 top
U$6  136.53,6.35 0 top

### Tracks (layer width: path | path; a pad name or v marks a point on that pad's centre or on a via)
+12V  (2 unrouted)
-INCA  (1 unrouted)
-INCDR  (1 unrouted)
-INCPC  (via drill 0.6)
  Top 0.305: IC1.5 115.57,68.58 114.3,67.31 v114.3,62.87 | v140.34,29.84 138.43,31.75 136.53,33.66 136.53,60.96 135.89,61.59 v135.89,62.23 | v145.41,29.84 148.59,26.67 151.13,26.67 CTRL.B25
  Bottom 0.305: v114.3,62.87 114.94,62.23 v135.89,62.23 | v140.34,29.84 v145.41,29.84
-LOAD_A  (via drill 0.6)
  Top 0.305: v48.9,12.7 48.26,13.34 48.26,24.77 46.99,26.04 IC15.11 46.99,31.75 45.72,33.02 v45.72,62.87 | v50.8,90.81 50.8,82.55 49.53,81.28 IC13.11 | v62.23,62.23 63.5,63.5 63.5,67.94 62.23,69.22 v62.23,79.38
  Bottom 0.305: v48.9,12.7 53.98,12.7 54.61,13.34 IC16.11 | IC14.11 57.15,91.44 56.52,90.81 v50.8,90.81 | v45.72,62.87 61.59,62.87 v62.23,62.23 | v62.23,79.38 58.42,79.38 55.88,76.83 50.16,76.83 49.53,77.47 IC13.11
-LOAD_DR  (via drill 0.6)
  Top 0.305: v83.19,12.7 82.55,13.34 82.55,24.77 81.28,26.04 IC9.11 81.28,31.75 80.01,33.02 v80.01,62.87 | v85.09,90.81 85.09,82.55 83.82,81.28 IC7.11 | v96.52,79.38 96.52,69.22 97.79,67.94 97.79,63.5 v96.52,62.23
  Bottom 0.305: IC10.11 88.9,13.34 88.27,12.7 v83.19,12.7 | IC8.11 91.44,91.44 90.81,90.81 v85.09,90.81 | IC7.11 83.82,77.47 84.45,76.83 90.17,76.83 92.71,79.38 v96.52,79.38 | v96.52,62.23 95.89,62.87 v80.01,62.87
-LOAD_PC  (via drill 0.6)
  Top 0.305: v117.47,12.7 116.84,13.34 116.84,25.4 115.57,26.67 IC3.11 115.57,31.75 114.3,33.02 v114.3,60.96 | v119.38,90.17 119.38,83.19 118.11,81.92 IC1.11 | v108.58,76.2 106.68,74.3 v106.68,67.31
  Bottom 0.305: v117.47,12.7 122.56,12.7 123.19,13.34 IC4.11 | IC2.11 125.73,91.44 125.09,90.81 120.02,90.81 v119.38,90.17 | IC1.11 118.11,77.47 117.47,76.83 109.22,76.83 v108.58,76.2 | v106.68,67.31 106.68,61.59 107.31,60.96 v114.3,60.96
-R_A  (via drill 0.6)
  Top 0.305: v39.37,62.23 IC17.1 IC18.19 v39.37,38.1 | v41.91,63.5 41.91,62.23 43.18,60.96 43.18,50.8 v43.81,50.16
  Bottom 0.305: v39.37,62.23 40.64,62.23 v41.91,63.5 IC17.19 | v39.37,38.1 37.47,38.1 36.83,37.47 IC18.1 | v43.81,50.16 46.99,50.16 47.62,50.8 48.9,50.8 49.53,50.16 53.98,50.16 54.61,49.53 56.52,49.53 57.15,48.9 59.05,48.9 59.69,48.26 111.12,48.26 112.39,46.99 120.65,46.99 121.92,45.72 130.18,45.72 133.99,41.91 151.13,41.91 CTRL.B19
-R_DR  (via drill 0.6)  (1 unrouted)
  Top 0.305: v73.66,38.1 IC12.19 IC11.1 v73.66,62.23
  Bottom 0.305: IC12.1 71.12,37.47 71.75,38.1 v73.66,38.1 | v73.66,62.23 75.56,62.23 76.2,62.87 IC11.19 | CTRL.B21 151.13,36.83 144.78,36.83 142.88,34.92
-R_PC  (via drill 0.6)  (1 unrouted)
  Top 0.305: v107.95,38.1 IC6.19 IC5.1 v107.95,62.23
  Bottom 0.305: IC6.1 105.41,37.47 106.05,38.1 v107.95,38.1 | v107.95,62.23 109.86,62.23 110.49,62.87 IC5.19
-RESET  (via drill 0.6)
  Top 0.305: v6.99,71.12 6.35,71.12 5.08,69.85 5.08,9.53 v10.79,3.81 | v144.15,3.81 145.41,5.08 145.41,12.06 148.59,15.24 CTRL.C30
  Bottom 0.305: v6.99,71.12 IC19.1 | v10.79,3.81 12.06,2.54 142.88,2.54 v144.15,3.81
A0  (via drill 0.6)
  Top 0.305: IC13.3 41.91,68.58 40.64,67.31 40.64,61.59 v41.91,60.33 IC17.2
  Bottom 0.305: IC26.5 21.59,59.69 22.23,60.33 v41.91,60.33
A1  (via drill 0.6)
  Top 0.305: v43.18,69.22 43.18,62.23 44.45,60.96 IC17.3 | IC26.4 19.05,60.33 17.78,61.59 v17.78,68.58
  Bottom 0.305: 39.37,69.85 IC13.2 | 39.37,69.85 40.01,69.22 v43.18,69.22 | v17.78,68.58 18.41,69.22 38.73,69.22 39.37,69.85
A2  (via drill 0.6)
  Top 0.305: IC13.6 49.53,68.58 48.26,67.31 48.26,61.59 46.99,60.33 IC17.4 v46.99,53.34 | IC26.3 16.51,53.98 v17.78,52.7
  Bottom 0.305: v17.78,52.7 46.35,52.7 v46.99,53.34
A3  (via drill 0.6)
  Top 0.305: IC13.7 52.07,68.58 50.8,67.31 50.8,61.59 49.53,60.33 IC17.5 | IC26.2 13.97,60.33 12.7,61.59 12.7,73.03 v13.97,74.3
  Bottom 0.305: v13.97,74.3 30.48,74.3 31.75,73.03 51.44,73.03 52.07,72.39 IC13.7
A4  (via drill 0.6)
  Top 0.305: v62.23,82.55 63.5,81.28 63.5,69.85 64.14,69.22 v64.14,60.96 | v29.21,59.05 29.21,66.67 v28.57,67.31
  Bottom 0.305: IC14.3 49.53,83.82 50.16,83.19 61.59,83.19 v62.23,82.55 | v64.14,60.96 62.23,60.96 60.33,59.05 52.7,59.05 52.07,58.42 | 52.07,58.42 IC17.6 | 52.07,58.42 51.44,59.05 v29.21,59.05 | v28.57,67.31 17.14,67.31 16.51,66.67 IC26.12
A5  (via drill 0.6)
  Top 0.305: v20.32,55.24 20.32,60.33 19.05,61.59 IC26.11 19.05,67.94 20.32,69.22 20.32,85.72 v21.59,87
  Bottom 0.305: IC17.7 54.61,55.88 53.98,55.24 v20.32,55.24 | IC14.2 46.99,86.36 46.35,87 v21.59,87
A6  (via drill 0.6)
  Top 0.305: IC14.6 57.15,76.83 57.78,76.2 57.78,74.93 57.15,74.3 57.15,69.22 58.42,67.94 58.42,61.59 57.15,60.33 IC17.8 | IC26.10 21.59,67.31 22.86,68.58 22.86,87 v24.13,88.27
  Bottom 0.305: v24.13,88.27 24.77,87.63 37.47,87.63 46.99,87.63 47.62,88.27 48.9,88.27 49.53,87.63 55.88,87.63 57.15,86.36 IC14.6
A7  (via drill 0.6)
  Top 0.305: IC14.7 v59.69,81.92 59.69,69.22 60.96,67.94 60.96,61.59 59.69,60.33 IC17.9 | IC26.9 24.13,67.31 25.4,68.58 25.4,82.55 v26.67,83.82
  Bottom 0.305: v26.67,83.82 42.55,83.82 43.18,83.19 48.9,83.19 50.16,81.92 v59.69,81.92
A8  (via drill 0.6)
  Top 0.305: IC15.3 39.37,24.77 v37.47,26.67 38.1,27.3 38.1,31.75 39.37,33.02 IC18.2 | v21.59,25.4 IC25.5
  Bottom 0.305: v37.47,26.67 35.56,24.77 22.23,24.77 v21.59,25.4
A9  (via drill 0.6)
  Top 0.305: IC18.3 41.91,33.02 40.64,31.75 40.64,19.68 40.01,19.05 37.47,19.05 36.83,19.68 IC15.2 | v19.05,20.95 IC25.4
  Bottom 0.305: v19.05,20.95 20.32,20.95 22.86,18.41 34.92,18.41 36.83,20.32 IC15.2
A10  (via drill 0.6)
  Top 0.305: IC15.6 46.99,24.77 45.72,26.04 v45.72,31.11 44.45,32.38 IC18.4 | v16.51,31.75 IC25.3
  Bottom 0.305: v16.51,31.75 45.09,31.75 v45.72,31.11
A11  (via drill 0.6)
  Top 0.305: IC15.7 49.53,24.77 48.26,26.04 48.26,31.75 46.99,33.02 IC18.5 | v13.97,20.95 IC25.2
  Bottom 0.305: v13.97,20.95 15.24,19.68 20.32,19.68 22.23,17.78 41.91,17.78 43.81,19.68 48.9,19.68 49.53,20.32 IC15.7
A12  (via drill 0.6)
  Top 0.305: IC16.3 46.99,10.79 47.62,11.43 49.53,11.43 50.8,12.7 50.8,31.75 49.53,33.02 IC18.6 49.53,38.73 48.26,40.01 v48.26,49.53
  Bottom 0.305: IC25.12 16.51,45.72 19.68,48.9 47.62,48.9 v48.26,49.53
A13  (via drill 0.6)
  Top 0.305: v52.07,18.41 53.34,19.68 53.34,31.75 52.07,33.02 IC18.7 52.07,38.73 53.34,40.01 v53.34,48.9 | v43.18,17.14 43.18,12.06 44.45,10.79 IC16.2
  Bottom 0.305: v52.07,18.41 44.45,18.41 v43.18,17.14 | IC25.11 19.05,45.72 21.59,48.26 52.7,48.26 v53.34,48.9
A14  (via drill 0.6)
  Top 0.305: IC16.6 54.61,10.79 55.88,12.06 55.88,31.75 54.61,33.02 IC18.8 54.61,38.73 55.88,40.01 v55.88,48.26
  Bottom 0.305: v55.88,48.26 55.24,47.62 23.5,47.62 21.59,45.72 IC25.10
A15  (via drill 0.6)
  Top 0.305: IC16.7 57.15,10.79 58.42,12.06 58.42,31.75 57.15,33.02 IC18.9 57.15,38.73 58.42,40.01 v58.42,47.62
  Bottom 0.305: v58.42,47.62 57.78,46.99 25.4,46.99 24.13,45.72 IC25.9
F_ZERO  (via drill 0.6)
  Top 0.305: v144.15,5.71 144.15,37.47 CTRL.C19
  Bottom 0.305: IC27.1 11.43,5.08 12.7,3.81 142.24,3.81 v144.15,5.71
GND  (via drill 0.6)
  Top 0.305: IC2.4 120.65,87.63 v121.28,88.27 | IC14.4 v52.07,88.9 | IC8.4 v86.36,89.53
  Top 1.016: v26.67,50.8 IC26.7 | IC8.8 97.79,85.09 98.42,84.45 v98.42,78.74 | v131.44,35.56 v131.44,32.38 v131.44,29.21 v131.44,26.04 v131.44,20.32 v131.44,15.24 v131.44,7.62
  pour Bottom (isolate 0.61, no thermals): 0,99.06 0,0 160.02,0 160.02,100.33
IBUS0  (via drill 0.6)
  Top 0.305: IC17.18 44.45,67.94 45.72,69.22 v45.72,81.92 | IC7.15 73.66,81.28 v73.03,81.92 71.75,83.19 v65.41,83.19 | IC11.18 78.74,67.31 80.01,68.58 v80.01,81.92 | v107.31,81.92 107.95,81.28 IC1.15 | IC5.18 113.03,67.31 114.3,68.58 v114.3,81.92
  Bottom 0.305: CTRL.C5 127,78.74 124.46,81.28 118.11,81.28 117.47,81.92 v114.3,81.92 v107.31,81.92 106.05,81.92 105.41,81.28 83.82,81.28 83.19,81.92 v80.01,81.92 v73.03,81.92 | IC13.15 39.37,80.01 40.64,81.28 42.55,81.28 43.18,81.92 v45.72,81.92 48.9,81.92 49.53,81.28 57.78,81.28 58.42,80.64 60.33,80.64 60.96,81.28 63.5,81.28 v65.41,83.19
IBUS1  (via drill 0.6)
  Top 0.305: v40.64,76.83 37.47,76.83 36.83,76.2 IC13.1 | IC7.1 71.12,74.3 72.39,75.56 v72.39,80.64 71.12,81.92 v66.04,81.92 | IC11.17 81.28,67.31 82.55,68.58 82.55,73.03 81.28,74.3 81.28,76.2 82.55,77.47 v82.55,80.64 | IC1.1 105.41,74.3 106.68,75.56 v106.68,80.64 | IC5.17 115.57,67.31 116.84,68.58 v116.84,80.64 | IC17.17 46.99,67.94 48.26,69.22 v48.26,80.64
  Bottom 0.305: CTRL.C6 143.51,76.2 141.6,78.11 126.36,78.11 123.83,80.64 v116.84,80.64 v106.68,80.64 v82.55,80.64 v72.39,80.64 | v40.64,76.83 40.64,80.01 41.27,80.64 v48.26,80.64 56.52,80.64 57.15,80.01 60.96,80.01 61.59,80.64 64.77,80.64 v66.04,81.92
IBUS2  (via drill 0.6)
  Top 0.305: IC13.10 52.07,75.56 v50.8,74.3 50.8,68.58 49.53,67.31 IC17.16 | IC7.10 86.36,76.83 85.09,75.56 | v82.55,75.56 85.09,75.56 | 85.09,75.56 85.09,68.58 83.82,67.31 IC11.16 | IC1.10 v120.65,76.2 120.65,75.56 119.38,74.3 119.38,68.58 118.11,67.31 IC5.16
  Bottom 0.305: CTRL.C7 143.51,73.66 140.97,76.2 v120.65,76.2 118.75,76.2 117.47,74.93 103.5,74.93 102.87,74.3 99.69,74.3 95.89,78.11 92.71,78.11 90.81,76.2 83.19,76.2 v82.55,75.56 69.85,75.56 67.94,73.66 56.52,73.66 55.24,74.93 51.44,74.93 v50.8,74.3
IBUS3  (via drill 0.6)
  Top 0.305: IC13.9 54.61,74.93 v53.34,73.66 53.34,68.58 52.07,67.31 IC17.15 | IC7.9 v88.9,74.93 88.9,73.66 87.63,72.39 87.63,68.58 86.36,67.31 IC11.15 | IC1.9 v123.19,74.93 123.19,74.3 121.92,73.03 121.92,68.58 120.65,67.31 IC5.15
  Bottom 0.305: CTRL.C8 144.15,71.12 139.7,75.56 123.83,75.56 v123.19,74.93 119.38,74.93 118.75,74.3 104.14,74.3 103.5,73.66 99.06,73.66 95.89,76.83 92.71,76.83 91.44,75.56 89.53,75.56 v88.9,74.93 83.82,74.93 83.19,74.3 81.92,74.3 81.28,74.93 70.48,74.93 68.58,73.03 55.24,73.03 54.61,73.66 v53.34,73.66
IBUS4  (via drill 0.6)
  Top 0.305: IC17.14 54.61,67.31 55.88,68.58 55.88,73.03 55.24,73.66 55.24,76.2 55.88,76.83 v55.88,94.61 | IC11.14 88.9,67.31 90.17,68.58 90.17,80.64 89.53,81.28 89.53,83.19 90.17,83.82 v90.17,94.61 | v124.46,94.61 124.46,69.85 v125.09,69.22 | v142.88,69.85 142.88,73.03 144.78,74.93 144.78,87 144.15,87.63 144.15,92.08 v141.6,94.61 | v99.06,93.98 v106.68,93.98 | v64.14,93.98 v72.39,93.98
  Bottom 0.305: IC14.15 46.99,93.98 47.62,94.61 v55.88,94.61 63.5,94.61 v64.14,93.98 | 81.28,93.98 80.64,94.61 74.93,94.61 74.3,93.98 v72.39,93.98 | 81.28,93.98 IC8.15 | 81.28,93.98 81.92,94.61 v90.17,94.61 98.42,94.61 v99.06,93.98 | 115.57,93.98 114.94,94.61 112.39,94.61 111.76,93.98 v106.68,93.98 | IC5.14 123.19,67.31 v125.09,69.22 | 115.57,93.98 IC2.15 | 115.57,93.98 116.2,94.61 v124.46,94.61 v141.6,94.61 | CTRL.C9 148.59,69.85 v142.88,69.85
IBUS5  (via drill 0.6)
  Top 0.305: IC14.1 44.45,81.92 43.18,80.64 v43.18,75.56 | v56.52,75.56 56.52,68.58 57.15,67.94 IC17.13 57.15,61.59 55.88,60.33 v55.88,54.61 | CTRL.C10 146.69,62.87 146.69,55.24 v146.05,54.61 | v90.17,54.61 90.17,60.33 91.44,61.59 IC11.13 91.44,67.94 90.81,68.58 v90.81,82.55 | IC5.13 125.73,62.23 124.46,60.96 v124.46,54.61
  Bottom 0.305: v56.52,75.56 v43.18,75.56 | v146.05,54.61 v124.46,54.61 v90.17,54.61 v55.88,54.61 | IC8.1 78.74,83.82 79.38,83.19 83.19,83.19 84.45,81.92 90.17,81.92 v90.81,82.55 91.44,81.92 102.87,81.92 107.95,87 112.39,87 113.03,86.36 IC2.1
IBUS6  (via drill 0.6)
  Top 0.305: IC14.10 59.69,89.53 v58.42,88.27 58.42,69.22 59.69,67.94 IC17.12 | IC8.10 93.98,89.53 v92.71,88.27 92.71,69.22 93.98,67.94 IC11.12 | IC2.10 128.27,89.53 v127,88.27 127,70.48 128.27,69.22 IC5.12 | v145.41,88.27 146.05,87.63 146.05,74.3 144.15,72.39 v144.15,66.67 | v100.33,88.27 v106.68,88.27 | v65.41,88.27 v73.03,88.27
  Bottom 0.305: IC5.12 128.27,66.04 | v144.15,66.67 146.69,66.67 CTRL.C11 | v145.41,88.27 v127,88.27 125.73,89.53 120.65,89.53 120.02,88.9 110.49,88.9 109.86,88.27 v106.68,88.27 | v100.33,88.27 v92.71,88.27 88.9,88.27 88.27,87.63 83.82,87.63 83.19,88.27 v73.03,88.27 | v58.42,88.27 v65.41,88.27
IBUS7  (via drill 0.6)
  Top 0.305: IC17.11 62.23,67.94 60.96,69.22 60.96,88.27 62.23,89.53 IC14.9 62.23,94.61 64.14,96.52 v73.66,96.52 | IC11.11 96.52,67.94 95.25,69.22 95.25,88.27 96.52,89.53 IC8.9 96.52,95.89 | IC5.11 130.81,69.22 129.54,70.48 129.54,88.27 130.81,89.53 IC2.9 130.81,95.25 v130.18,95.89 | v95.89,96.52 96.52,95.89 | 96.52,95.89 98.42,95.89 99.06,96.52 v107.95,96.52 | v145.41,64.77 145.41,71.75 147.32,73.66 147.32,93.34 v144.78,95.89
  Bottom 0.305: v73.66,96.52 74.3,97.16 95.25,97.16 v95.89,96.52 | v107.95,96.52 110.49,96.52 111.12,97.16 118.75,97.16 120.02,95.89 v130.18,95.89 v144.78,95.89 | CTRL.C12 149.22,60.96 v145.41,64.77
IBUS8  (via drill 0.6)
  Top 0.305: IC15.15 36.83,31.75 38.1,33.02 v38.1,45.09 | IC9.15 71.12,31.75 72.39,33.02 v72.39,46.99 | IC3.15 105.41,31.75 106.68,33.02 v106.68,46.99 | v75.56,46.99 76.2,46.35 IC12.18 | v109.86,46.99 110.49,46.35 IC6.18 v110.49,40.01
  Bottom 0.305: v38.1,45.09 38.73,45.72 41.27,45.72 41.91,45.09 | 41.91,45.09 IC18.18 | 41.91,45.09 41.91,45.72 42.55,46.35 59.05,46.35 59.69,46.99 v72.39,46.99 v75.56,46.99 v106.68,46.99 v109.86,46.99 | CTRL.C21 147.96,40.01 v110.49,40.01
IBUS9  (via drill 0.6)
  Top 0.305: IC9.1 68.58,24.13 69.85,25.4 69.85,33.02 v69.22,33.66 | v69.22,33.66 69.22,37.47 v71.12,39.37 | IC3.1 102.87,24.77 104.14,26.04 104.14,33.02 v103.5,33.66 | IC15.1 34.29,24.13 35.56,25.4 35.56,33.02 v34.92,33.66 34.92,37.47 v36.83,39.37 | v103.5,33.66 103.5,37.47 v105.41,39.37 | v63.5,33.66 v69.22,33.66 | v98.42,33.66 v103.5,33.66
  Bottom 0.305: CTRL.C22 145.41,35.56 143.51,33.66 v103.5,33.66 | v71.12,39.37 73.03,41.27 78.11,41.27 78.74,41.91 IC12.17 | v36.83,39.37 38.73,41.27 43.81,41.27 44.45,41.91 IC18.17 | v105.41,39.37 107.31,41.27 112.39,41.27 113.03,41.91 IC6.17 | v34.92,33.66 v63.5,33.66 | v69.22,33.66 v98.42,33.66
IBUS10  (2 unrouted)
  Top 0.305: IC18.16 46.99,40.01 48.26,38.73 48.26,33.02 49.53,31.75 IC15.10 | IC12.16 81.28,40.01 82.55,38.73 82.55,33.02 83.82,31.75 IC9.10 | IC6.16 115.57,40.01 116.84,38.73 116.84,33.02 118.11,31.75 IC3.10
  Bottom 0.305: IC3.10 118.11,30.48 118.75,31.11 143.51,31.11 145.41,33.02 CTRL.C23
IBUS11  (2 unrouted)
  Top 0.305: IC15.9 52.07,31.75 50.8,33.02 50.8,38.73 49.53,40.01 IC18.15 | IC12.15 83.82,40.01 85.09,38.73 85.09,33.02 86.36,31.75 IC9.9 | IC6.15 118.11,40.64 119.38,39.37 119.38,33.02 120.65,31.75 IC3.9
  Bottom 0.305: CTRL.C24 149.22,30.48 146.05,27.3 121.28,27.3 120.65,27.94 IC3.9
IBUS12  (via drill 0.6)
  Top 0.305: IC16.15 44.45,17.78 43.18,19.05 v43.18,45.09 | IC10.15 78.74,17.78 77.47,19.05 v77.47,45.09 | IC4.15 113.03,17.78 111.76,19.05 v111.76,24.13 v111.76,45.09
  Bottom 0.305: v43.18,45.09 43.81,45.72 51.44,45.72 52.07,45.09 | 52.07,45.09 IC18.14 | 86.36,45.09 85.72,45.72 78.11,45.72 v77.47,45.09 76.83,45.72 52.7,45.72 52.07,45.09 | 86.36,45.09 IC12.14 | 86.36,45.09 87,45.72 111.12,45.72 v111.76,45.09 112.39,45.72 120.02,45.72 120.65,45.09 IC6.14 | CTRL.C25 149.22,27.94 145.41,24.13 v111.76,24.13
IBUS13  (via drill 0.6)
  Top 0.305: IC18.13 54.61,40.01 53.34,38.73 53.34,33.02 54.61,31.75 54.61,19.05 53.34,17.78 53.34,6.35 | IC16.1 41.91,6.35 43.18,5.08 52.07,5.08 53.34,6.35 | IC12.13 88.9,40.01 87.63,38.73 87.63,33.02 88.9,31.75 88.9,18.41 87.63,17.14 87.63,6.35 | 87.63,6.35 86.36,5.08 77.47,5.08 76.2,6.35 | 76.2,6.35 IC10.1 | 53.34,6.35 v54.61,5.08 | v74.93,5.08 76.2,6.35 | 87.63,6.35 v88.9,5.08 | v109.22,5.08 110.49,6.35 | 110.49,6.35 IC4.1 | IC6.13 123.19,40.64 121.92,39.37 121.92,33.02 123.19,31.75 v123.19,22.86 123.19,18.41 121.92,17.14 121.92,6.35 120.65,5.08 111.76,5.08 110.49,6.35
  Bottom 0.305: v54.61,5.08 55.24,4.45 74.3,4.45 v74.93,5.08 | v88.9,5.08 89.53,4.45 108.58,4.45 v109.22,5.08 | CTRL.C26 149.22,25.4 146.69,22.86 v123.19,22.86
IBUS14  (2 unrouted)
  Top 0.305: IC16.10 57.15,31.75 55.88,33.02 55.88,38.73 57.15,40.01 IC18.12 | IC12.12 91.44,40.01 90.17,38.73 90.17,33.02 91.44,31.75 IC10.10 | IC6.12 125.73,40.64 124.46,39.37 124.46,33.02 125.73,31.75 IC4.10
  Bottom 0.305: IC4.10 125.73,16.51 127,17.78 144.78,17.78 CTRL.C27
IBUS15  (2 unrouted)
  Top 0.305: IC16.9 59.69,31.75 58.42,33.02 58.42,38.73 59.69,40.01 IC18.11 | IC12.11 93.98,40.01 92.71,38.73 92.71,33.02 93.98,31.75 IC10.9 | IC6.11 128.27,40.64 127,39.37 127,33.02 128.27,31.75 IC4.9
  Bottom 0.305: CTRL.C28 146.69,17.14 128.91,17.14 128.27,16.51 IC4.9
N$3
  Top 0.305: IC1.3 110.49,68.58 109.22,67.31 109.22,61.59 110.49,60.33 IC5.2
N$4  (via drill 0.6)
  Top 0.305: IC5.3 113.03,60.33 111.76,61.59 v111.76,69.22
  Bottom 0.305: v111.76,69.22 108.58,69.22 107.95,69.85 IC1.2
N$5
  Top 0.305: IC5.4 115.57,60.33 116.84,61.59 116.84,67.31 118.11,68.58 IC1.6
N$6
  Top 0.305: IC1.7 120.65,68.58 119.38,67.31 119.38,61.59 118.11,60.33 IC5.5
N$7  (via drill 0.6)
  Top 0.305: v132.08,83.19 133.35,81.92 133.35,60.33 v133.99,59.69
  Bottom 0.305: IC2.3 118.11,83.82 118.75,83.19 v132.08,83.19 | v133.99,59.69 121.92,59.69 120.65,58.42 IC5.6
N$8  (via drill 0.6)
  Top 0.305: v132.72,58.42 132.72,80.64 v131.44,81.92
  Bottom 0.305: IC5.7 123.19,58.42 123.83,59.05 132.08,59.05 v132.72,58.42 | v131.44,81.92 130.81,82.55 116.84,82.55 115.57,83.82 IC2.2
N$9
  Top 0.305: IC2.6 125.73,70.48 127,69.22 127,61.59 125.73,60.33 IC5.8
N$10
  Top 0.305: IC2.7 128.27,70.48 129.54,69.22 129.54,61.59 128.27,60.33 IC5.9
N$11
  Top 0.305: IC6.2 107.95,33.02 106.68,31.75 106.68,26.67 107.95,25.4 IC3.3
N$12
  Top 0.305: IC6.3 110.49,33.02 109.22,31.75 109.22,19.68 108.58,19.05 106.05,19.05 105.41,19.68 IC3.2
N$13
  Top 0.305: IC6.4 113.03,33.02 114.3,31.75 114.3,26.67 115.57,25.4 IC3.6
N$14
  Top 0.305: IC6.6 118.11,33.02 119.38,31.75 119.38,12.7 118.11,11.43 116.2,11.43 115.57,10.79 IC4.3
N$15  (via drill 0.6)
  Top 0.305: IC6.7 120.65,33.02 121.92,31.75 121.92,19.05 v120.65,17.78 | v111.76,17.14 111.76,12.06 113.03,10.79 IC4.2
  Bottom 0.305: v120.65,17.78 120.02,18.41 113.03,18.41 v111.76,17.14
N$17
  Top 0.305: IC27.2 13.97,10.79 15.24,12.06 15.24,38.73 13.97,40.01 IC25.13
N$18
  Top 0.305: IC25.1 11.43,18.41 12.7,17.14 12.7,5.71 13.34,5.08 15.88,5.08 16.51,5.71 IC27.3
N$19
  Top 0.305: IC27.4 19.05,10.79 17.78,12.06 17.78,50.8 15.24,53.34 15.24,60.33 13.97,61.59 IC26.13
N$20  (via drill 0.6)
  Top 0.305: IC27.5 21.59,10.79 20.32,12.06 20.32,17.78 v19.68,18.41 | v12.7,19.68 12.7,52.07 11.43,53.34 11.43,55.88 12.06,56.52 IC26.1
  Bottom 0.305: v19.68,18.41 13.97,18.41 v12.7,19.68
N$22
  Top 0.305: IC6.5 115.57,33.02 116.84,31.75 116.84,26.67 118.11,25.4 IC3.7
N$25  (via drill 0.6)
  Top 0.305: IC1.12 115.57,81.92 116.84,83.19 v116.84,87
  Bottom 0.305: v116.84,87 122.56,87 123.19,86.36 IC2.5
N$26  (via drill 0.6)
  Top 0.305: IC13.12 46.99,81.28 48.26,82.55 v48.26,87
  Bottom 0.305: v48.26,87 53.98,87 54.61,86.36 IC14.5
N$27  (via drill 0.6)
  Top 0.305: v53.98,89.53 54.61,90.17 IC14.12 | v64.14,90.81 64.14,82.55 64.77,81.92 64.77,70.48 65.41,69.85 65.41,60.33 64.14,59.05 64.14,46.35 60.96,43.18 v60.96,23.5
  Bottom 0.305: IC15.5 44.45,22.86 45.09,23.5 v60.96,23.5 | v53.98,89.53 57.15,89.53 58.42,90.81 v64.14,90.81
N$28  (via drill 0.6)
  Top 0.305: v82.55,87 82.55,82.55 81.28,81.28 IC7.12
  Bottom 0.305: IC8.5 88.9,86.36 88.27,87 v82.55,87
N$29  (via drill 0.6)
  Top 0.305: IC2.12 123.19,88.27 121.92,87 121.92,74.93 v120.65,73.66 | v135.25,71.75 134.62,71.12 134.62,60.96 135.25,60.33 135.25,47.62 129.54,41.91 v129.54,19.05
  Bottom 0.305: v120.65,73.66 125.09,73.66 127,71.75 v135.25,71.75 | v129.54,19.05 121.28,19.05 120.65,19.68 113.67,19.68 113.03,20.32 IC3.5
N$30  (via drill 0.6)
  Top 0.305: IC8.12 88.9,88.27 87.63,87 87.63,74.3 v87,73.66 | v99.69,72.39 98.42,71.12 98.42,45.09 95.25,41.91 v95.25,23.5
  Bottom 0.305: IC9.5 78.74,22.86 79.38,23.5 v95.25,23.5 | v99.69,72.39 99.06,72.39 95.25,76.2 93.34,76.2 92.08,74.93 90.81,74.93 89.53,73.66 v87,73.66
N$31
  Top 0.305: IC3.12 113.03,26.67 114.3,25.4 114.3,6.35 114.94,5.71 120.02,5.71 120.65,6.35 IC4.5
N$32
  Top 0.305: IC4.6 123.19,11.43 124.46,12.7 124.46,31.75 123.19,33.02 IC6.8
N$33
  Top 0.305: IC6.9 125.73,33.02 127,31.75 127,12.06 125.73,10.79 IC4.7
N$39
  Top 0.305: IC9.12 78.74,26.04 80.01,24.77 80.01,6.35 80.64,5.71 85.72,5.71 86.36,6.35 IC10.5
N$43
  Top 0.305: IC7.3 76.2,68.58 74.93,67.31 74.93,61.59 76.2,60.33 IC11.2
N$44  (via drill 0.6)
  Top 0.305: v77.47,66.67 77.47,61.59 78.74,60.33 IC11.3
  Bottom 0.305: IC7.2 73.66,69.85 74.3,69.22 76.83,66.67 v77.47,66.67
N$45
  Top 0.305: IC7.6 83.82,68.58 82.55,67.31 82.55,61.59 81.28,60.33 IC11.4
N$46
  Top 0.305: IC7.7 86.36,68.58 85.09,67.31 85.09,61.59 83.82,60.33 IC11.5
N$58  (via drill 0.6)
  Top 0.305: v100.33,60.33 100.33,70.48 100.97,71.12 100.97,73.03 99.69,74.3 v99.69,87
  Bottom 0.305: IC8.3 83.82,83.82 84.45,83.19 89.53,83.19 90.17,83.82 90.17,86.36 90.81,87 v99.69,87 | IC11.6 86.36,58.42 87.63,59.69 99.69,59.69 v100.33,60.33
N$66  (via drill 0.6)
  Top 0.305: v66.67,59.69 v66.67,69.85 | IC11.7 88.9,58.42 88.27,59.05 v85.09,59.05 | v74.93,73.03 v74.93,86.36
  Bottom 0.305: IC8.2 81.28,86.36 80.64,87 75.56,87 v74.93,86.36 | v66.67,59.69 67.31,59.05 v85.09,59.05 | v74.93,73.03 74.3,73.66 70.48,73.66 v66.67,69.85
N$67
  Top 0.305: IC8.6 91.44,83.82 92.08,83.19 92.08,81.28 91.44,80.64 91.44,69.22 92.71,67.94 92.71,61.59 91.44,60.33 IC11.8
N$68
  Top 0.305: IC8.7 93.98,69.22 95.25,67.94 95.25,61.59 93.98,60.33 IC11.9
N$69
  Top 0.305: IC12.2 73.66,33.02 72.39,31.75 72.39,26.04 73.66,24.77 IC9.3
N$70
  Top 0.305: IC12.3 76.2,33.02 74.93,31.75 74.93,19.68 74.3,19.05 71.75,19.05 71.12,19.68 IC9.2
N$71
  Top 0.305: IC12.4 78.74,33.02 80.01,31.75 80.01,26.04 81.28,24.77 IC9.6
N$72
  Top 0.305: IC12.5 81.28,33.02 82.55,31.75 82.55,26.04 83.82,24.77 IC9.7
N$73
  Top 0.305: IC10.3 81.28,10.79 81.92,11.43 83.82,11.43 85.09,12.7 85.09,31.75 83.82,33.02 IC12.6
N$74  (via drill 0.6)
  Top 0.305: IC10.2 78.74,10.79 77.47,12.06 v77.47,17.14 | v86.36,18.41 87.63,19.68 87.63,31.75 86.36,33.02 IC12.7
  Bottom 0.305: v77.47,17.14 78.74,18.41 v86.36,18.41
N$75
  Top 0.305: IC12.8 88.9,33.02 90.17,31.75 90.17,12.06 88.9,10.79 IC10.6
N$76
  Top 0.305: IC12.9 91.44,33.02 92.71,31.75 92.71,12.06 91.44,10.79 IC10.7
N$77
  Top 0.305: IC15.12 44.45,26.04 45.72,24.77 45.72,6.35 46.35,5.71 51.44,5.71 52.07,6.35 IC16.5
RESERVED_POWER  (2 unrouted)
RESET  (via drill 0.6)  (5 unrouted)
  Top 0.305: v46.99,12.7 IC16.14 | v36.2,10.79 34.29,10.79 33.02,12.06 33.02,18.41 v31.75,19.68 | v43.18,90.17 43.18,83.82 v41.91,82.55 IC13.14 | IC15.14 39.37,31.75 40.64,33.02 v40.64,53.98 | v15.88,81.28 15.24,80.64 15.24,73.66 13.97,72.39 IC19.2 13.97,69.22 15.24,67.94 15.24,62.23 17.78,59.69 17.78,54.61 19.05,53.34 19.05,47.62 20.32,46.35 v20.32,22.23 | IC14.14 49.53,94.61 v50.8,95.89 | IC7.14 76.2,81.92 77.47,83.19 v77.47,90.17 | v83.19,95.89 83.82,95.25 IC8.14 | IC1.14 110.49,81.28 111.76,82.55 v111.76,90.81 | v117.47,95.89 118.11,95.25 IC2.14 | v99.69,95.25 v107.31,95.25 | v64.77,95.25 v73.03,95.25
  Bottom 0.305: v36.2,10.79 38.73,10.79 40.64,12.7 v46.99,12.7 | IC15.14 39.37,26.67 35.56,22.86 35.56,20.32 34.29,19.05 32.38,19.05 v31.75,19.68 31.11,19.05 23.5,19.05 v20.32,22.23 | IC14.14 49.53,91.44 48.9,90.81 46.35,90.81 45.72,90.17 v43.18,90.17 | v15.88,81.28 16.51,81.92 41.27,81.92 v41.91,82.55 | v50.8,95.89 56.52,95.89 57.15,95.25 v64.77,95.25 | v111.76,90.81 112.39,90.17 117.47,90.17 118.11,90.81 IC2.14 | v77.47,90.17 83.19,90.17 83.82,90.81 83.82,92.08 | v117.47,95.89 111.76,95.89 111.12,95.25 v107.31,95.25 | v99.69,95.25 95.25,95.25 94.61,95.89 v83.19,95.89 74.93,95.89 74.3,95.25 v73.03,95.25
VCC
  pour Top (isolate 0.61, no thermals): 1.27,99.06 1.27,0 160.02,0 160.02,99.06

### Text on the board
tNames: CFT CPU PC/DR/A Registers Rev C | Z Flag | Accumulator | Data Register | Program Counter